# EAGLE schematic EPS (EAGLE 9.5.1), part 1 of 2
DESIGNER: Bradley L. Davis; PART_NUMBER: 68-0002; PROJECT: CougSat-1: EPS; REV: 3.1.0

## Sheet 1 of 13
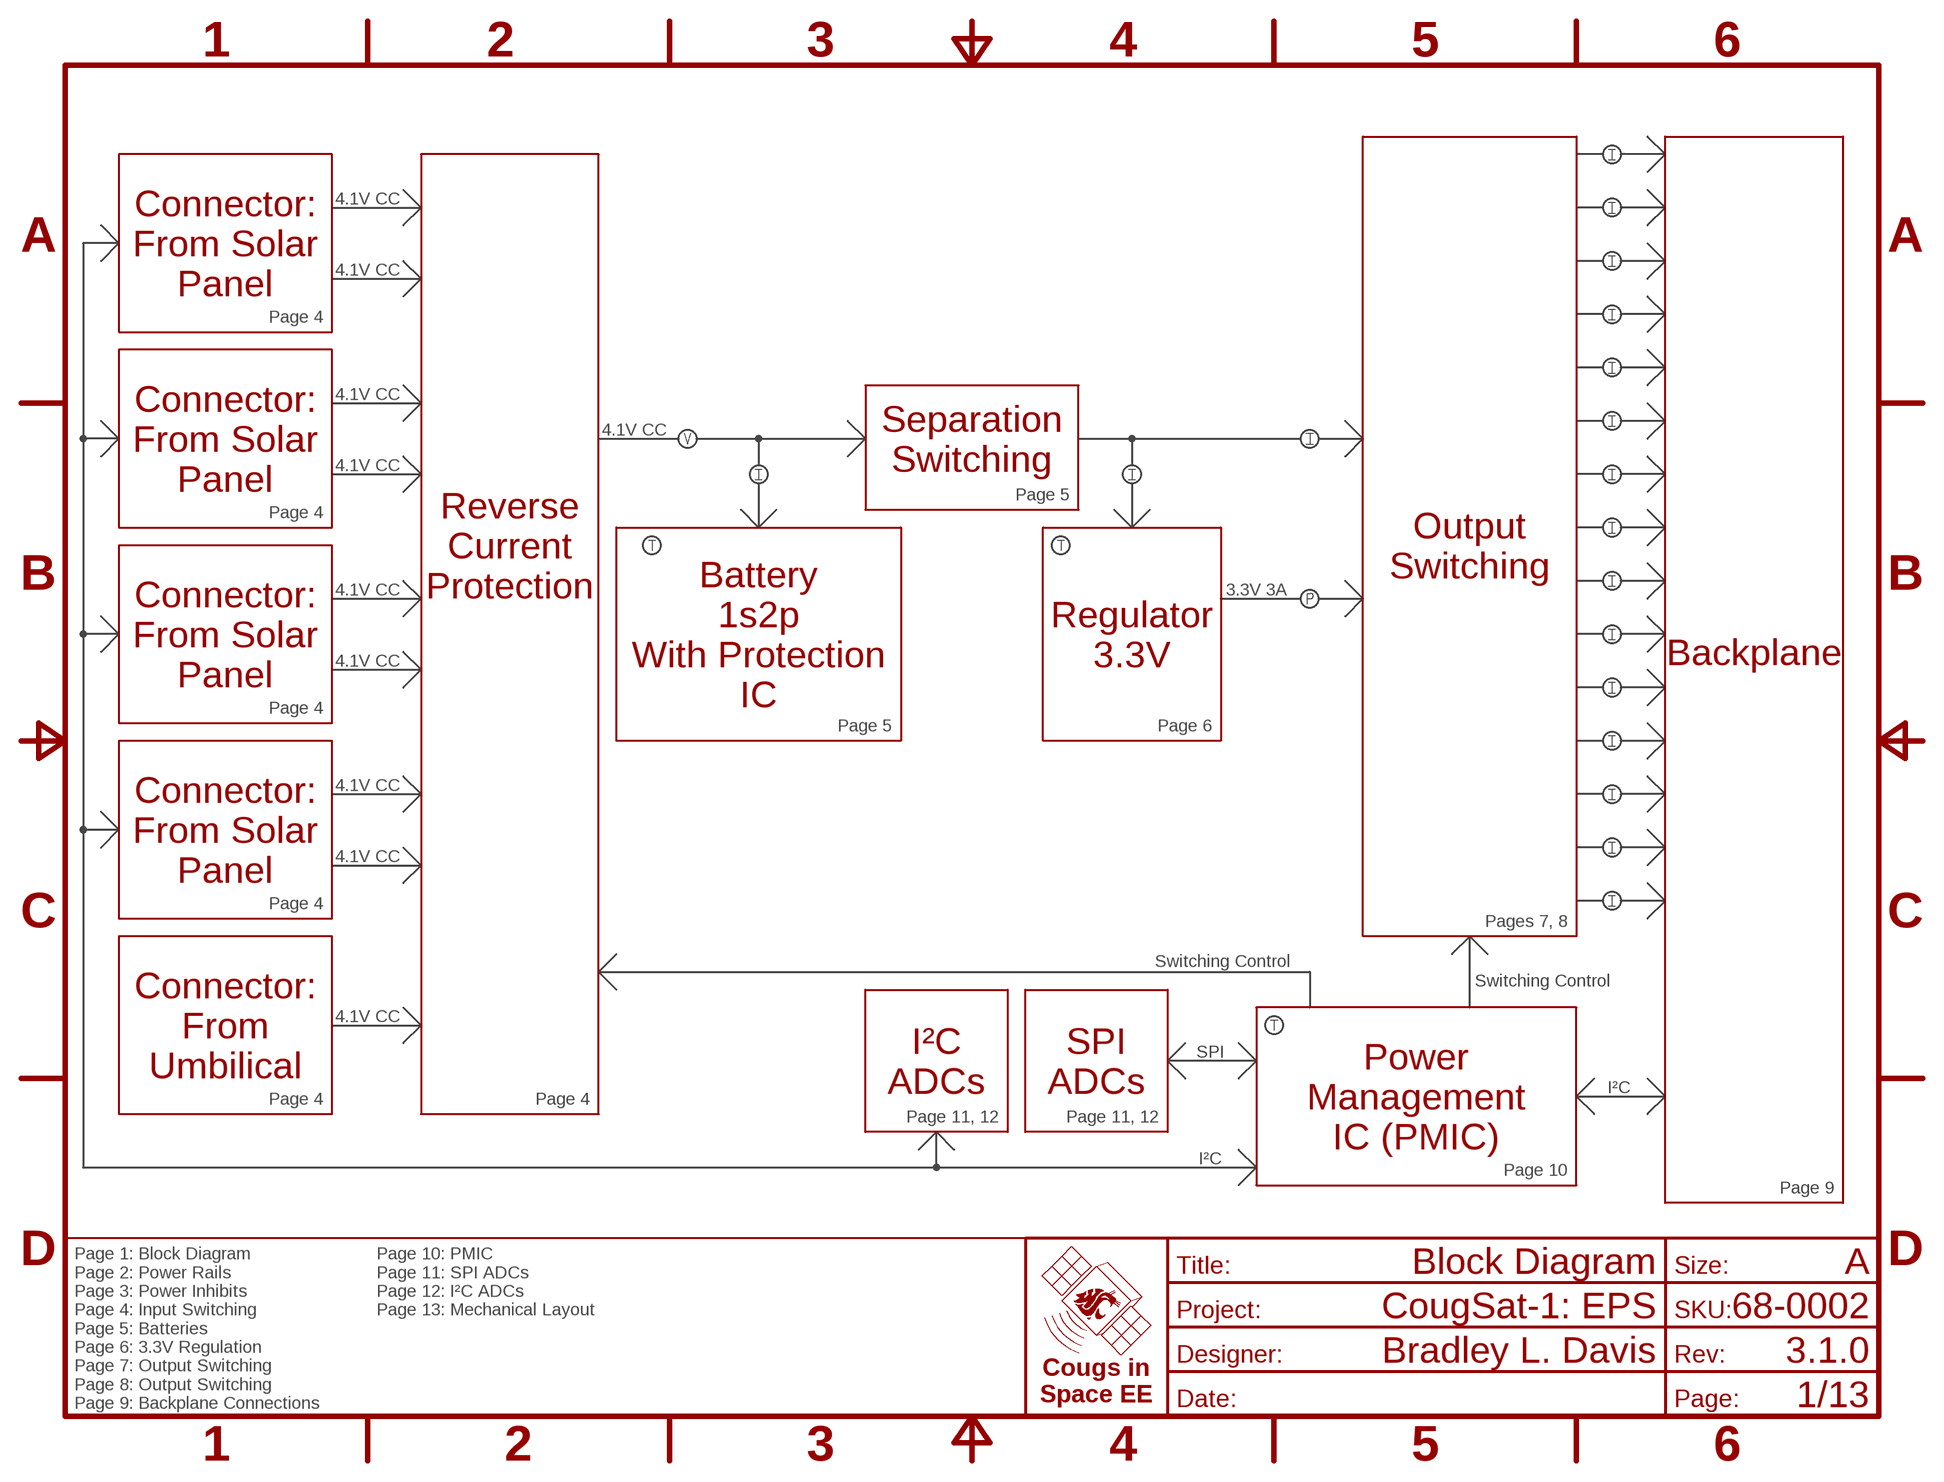
[diagram p0: schematic, sheet 1]
FRAME1 (FRAME-A): TITLE: Block Diagram

### Notes on the sheet
- 4.1V CC
- Connector:
  From Solar
  Panel
- 4.1V CC
- Page 4
- 4.1V CC
- 4.1V CC
- Connector:
  From Solar
  Panel
- Separation
  Switching
- 4.1V CC
- Page 5
- Page 4
- Reverse
  Current
  Protection
- Output
  Switching
- 4.1V CC | 3.3V 3A
- Connector:
  From Solar
  Panel
- Battery
  1s2p
  With Protection
  IC
- Regulator
  3.3V
- Backplane
- 4.1V CC
- Page 4
- Page 5 | Page 6
- 4.1V CC
- Connector:
  From Solar
  Panel
- 4.1V CC
- Page 4
- Pages 7, 8
- Switching Control
- Switching Control
- 4.1V CC
- Connector:
  From
  Umbilical
- SPI
- I²C
  ADCs
- SPI
  ADCs
- I²C
- Power
  Management
  IC (PMIC)
- Page 4 | Page 4
- Page 11, 12 | Page 11, 12
- I²C
- Page 10
- Page 9
- Page 1: Block Diagram
  Page 2: Power Rails
  Page 3: Power Inhibits
  Page 4: Input Switching
  Page 5: Batteries
  Page 6: 3.3V Regulation
  Page 7: Output Switching
  Page 8: Output Switching
  Page 9: Backplane Connections
- Page 10: PMIC
  Page 11: SPI ADCs
  Page 12: I²C ADCs
  Page 13: Mechanical Layout

## Sheet 2 of 13
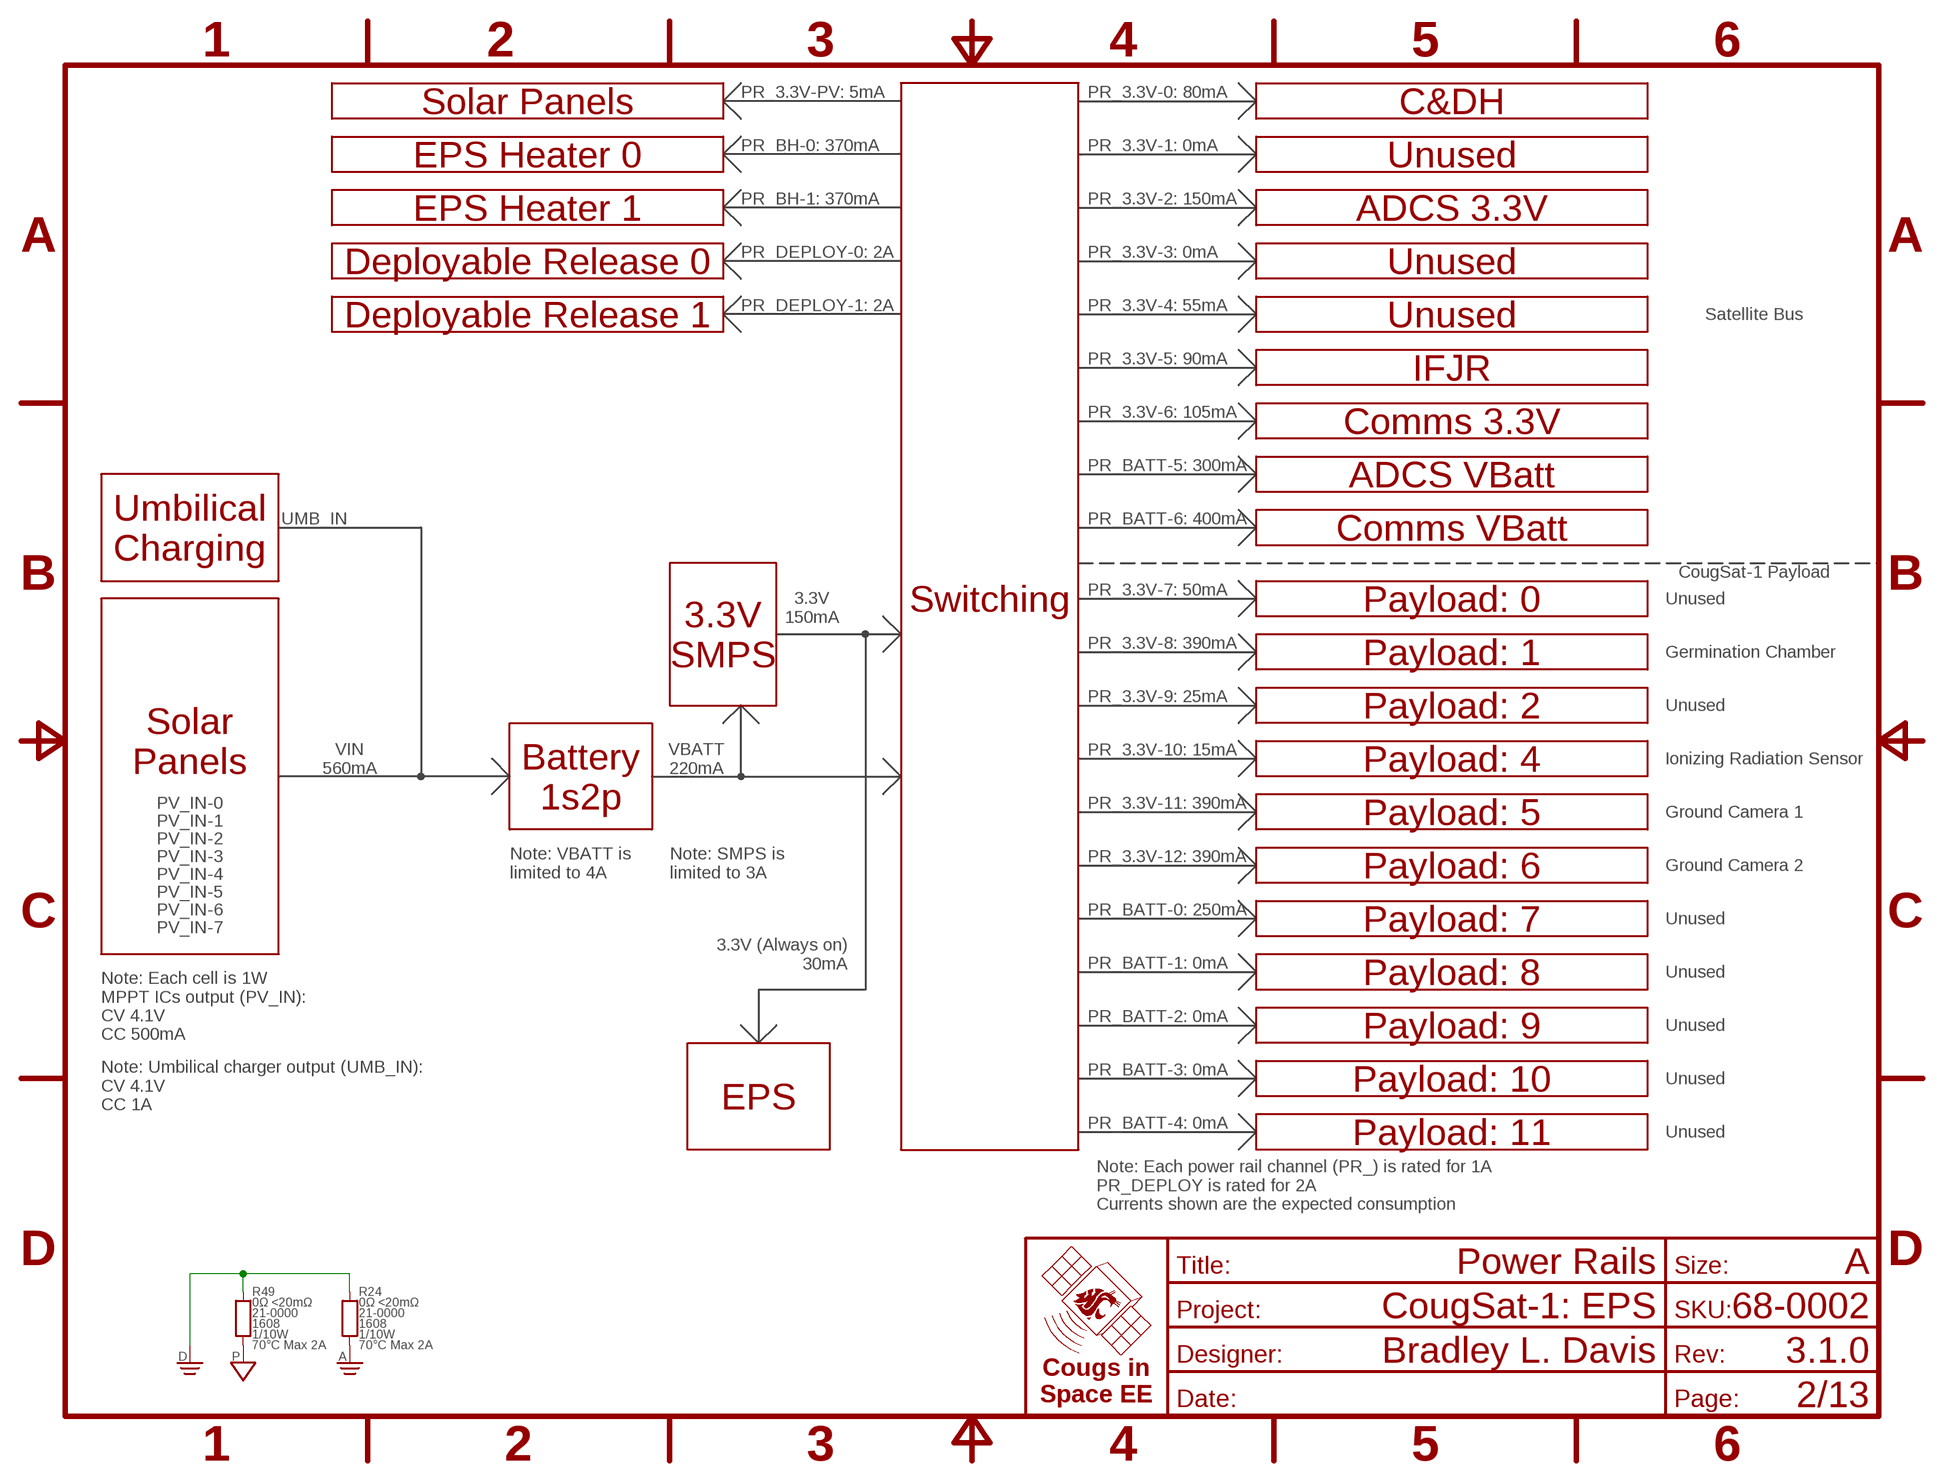
[diagram p1: schematic, sheet 2]
FRAME2 (FRAME-A): TITLE: Power Rails

### Parts
R24  0Ω <20mΩ  RES-V-0-1608  [1608]
R49  0Ω <20mΩ  RES-V-0-1608  [1608]

### Nets
AGND [power]: R24.1 ; also sheet 4,5,6,7,8,11,12
DGND [power]: R24.2 R49.2 ; also sheet 9,10,11,12
PGND [power]: R49.1 ; also sheet 4,5,6,7,8,9,12

### Notes on the sheet
- PR_3.3V-PV: 5mA | PR_3.3V-0: 80mA
- Solar Panels | C&DH
- PR_BH-0: 370mA | PR_3.3V-1: 0mA
- EPS Heater 0 | Unused
- PR_BH-1: 370mA | PR_3.3V-2: 150mA
- EPS Heater 1 | ADCS 3.3V
- PR_DEPLOY-0: 2A | PR_3.3V-3: 0mA
- Deployable Release 0 | Unused
- PR_DEPLOY-1: 2A | PR_3.3V-4: 55mA
- Deployable Release 1 | Unused | Satellite Bus
- PR_3.3V-5: 90mA
- IFJR
- PR_3.3V-6: 105mA
- Comms 3.3V
- PR_BATT-5: 300mA
- ADCS VBatt
- UMB_IN | PR_BATT-6: 400mA
- Umbilical
  Charging
- Comms VBatt
- CougSat-1 Payload
- PR_3.3V-7: 50mA
- Switching | Payload: 0 | Unused
- 3.3V
  150mA
- 3.3V
  SMPS
- PR_3.3V-8: 390mA
- Payload: 1 | Germination Chamber
- PR_3.3V-9: 25mA
- Payload: 2 | Unused
- Solar
  Panels
- PR_3.3V-10: 15mA
- VIN
  560mA
- VBATT
  220mA
- Payload: 4 | Ionizing Radiation Sensor
- Battery
  1s2p
- PV_IN-0 | PR_3.3V-11: 390mA
- Payload: 5 | Ground Camera 1
- PV_IN-1
- PV_IN-2
- Note: VBATT is
  limited to 4A
- Note: SMPS is
  limited to 3A
- PV_IN-3 | PR_3.3V-12: 390mA
- Payload: 6 | Ground Camera 2
- PV_IN-4
- PV_IN-5
- PV_IN-6 | PR_BATT-0: 250mA
- Payload: 7 | Unused
- PV_IN-7
- 3.3V (Always on)
  30mA
- PR_BATT-1: 0mA
- Note: Each cell is 1W
  MPPT ICs output (PV_IN):
  CV 4.1V 
  CC 500mA
- Payload: 8 | Unused
- PR_BATT-2: 0mA
- Payload: 9 | Unused
- Note: Umbilical charger output (UMB_IN):
  CV 4.1V
  CC 1A
- PR_BATT-3: 0mA
- Payload: 10 | Unused
- EPS
- PR_BATT-4: 0mA
- Payload: 11 | Unused
- Note: Each power rail channel (PR_) is rated for 1A
  PR_DEPLOY is rated for 2A
  Currents shown are the expected consumption

## Sheet 3 of 13
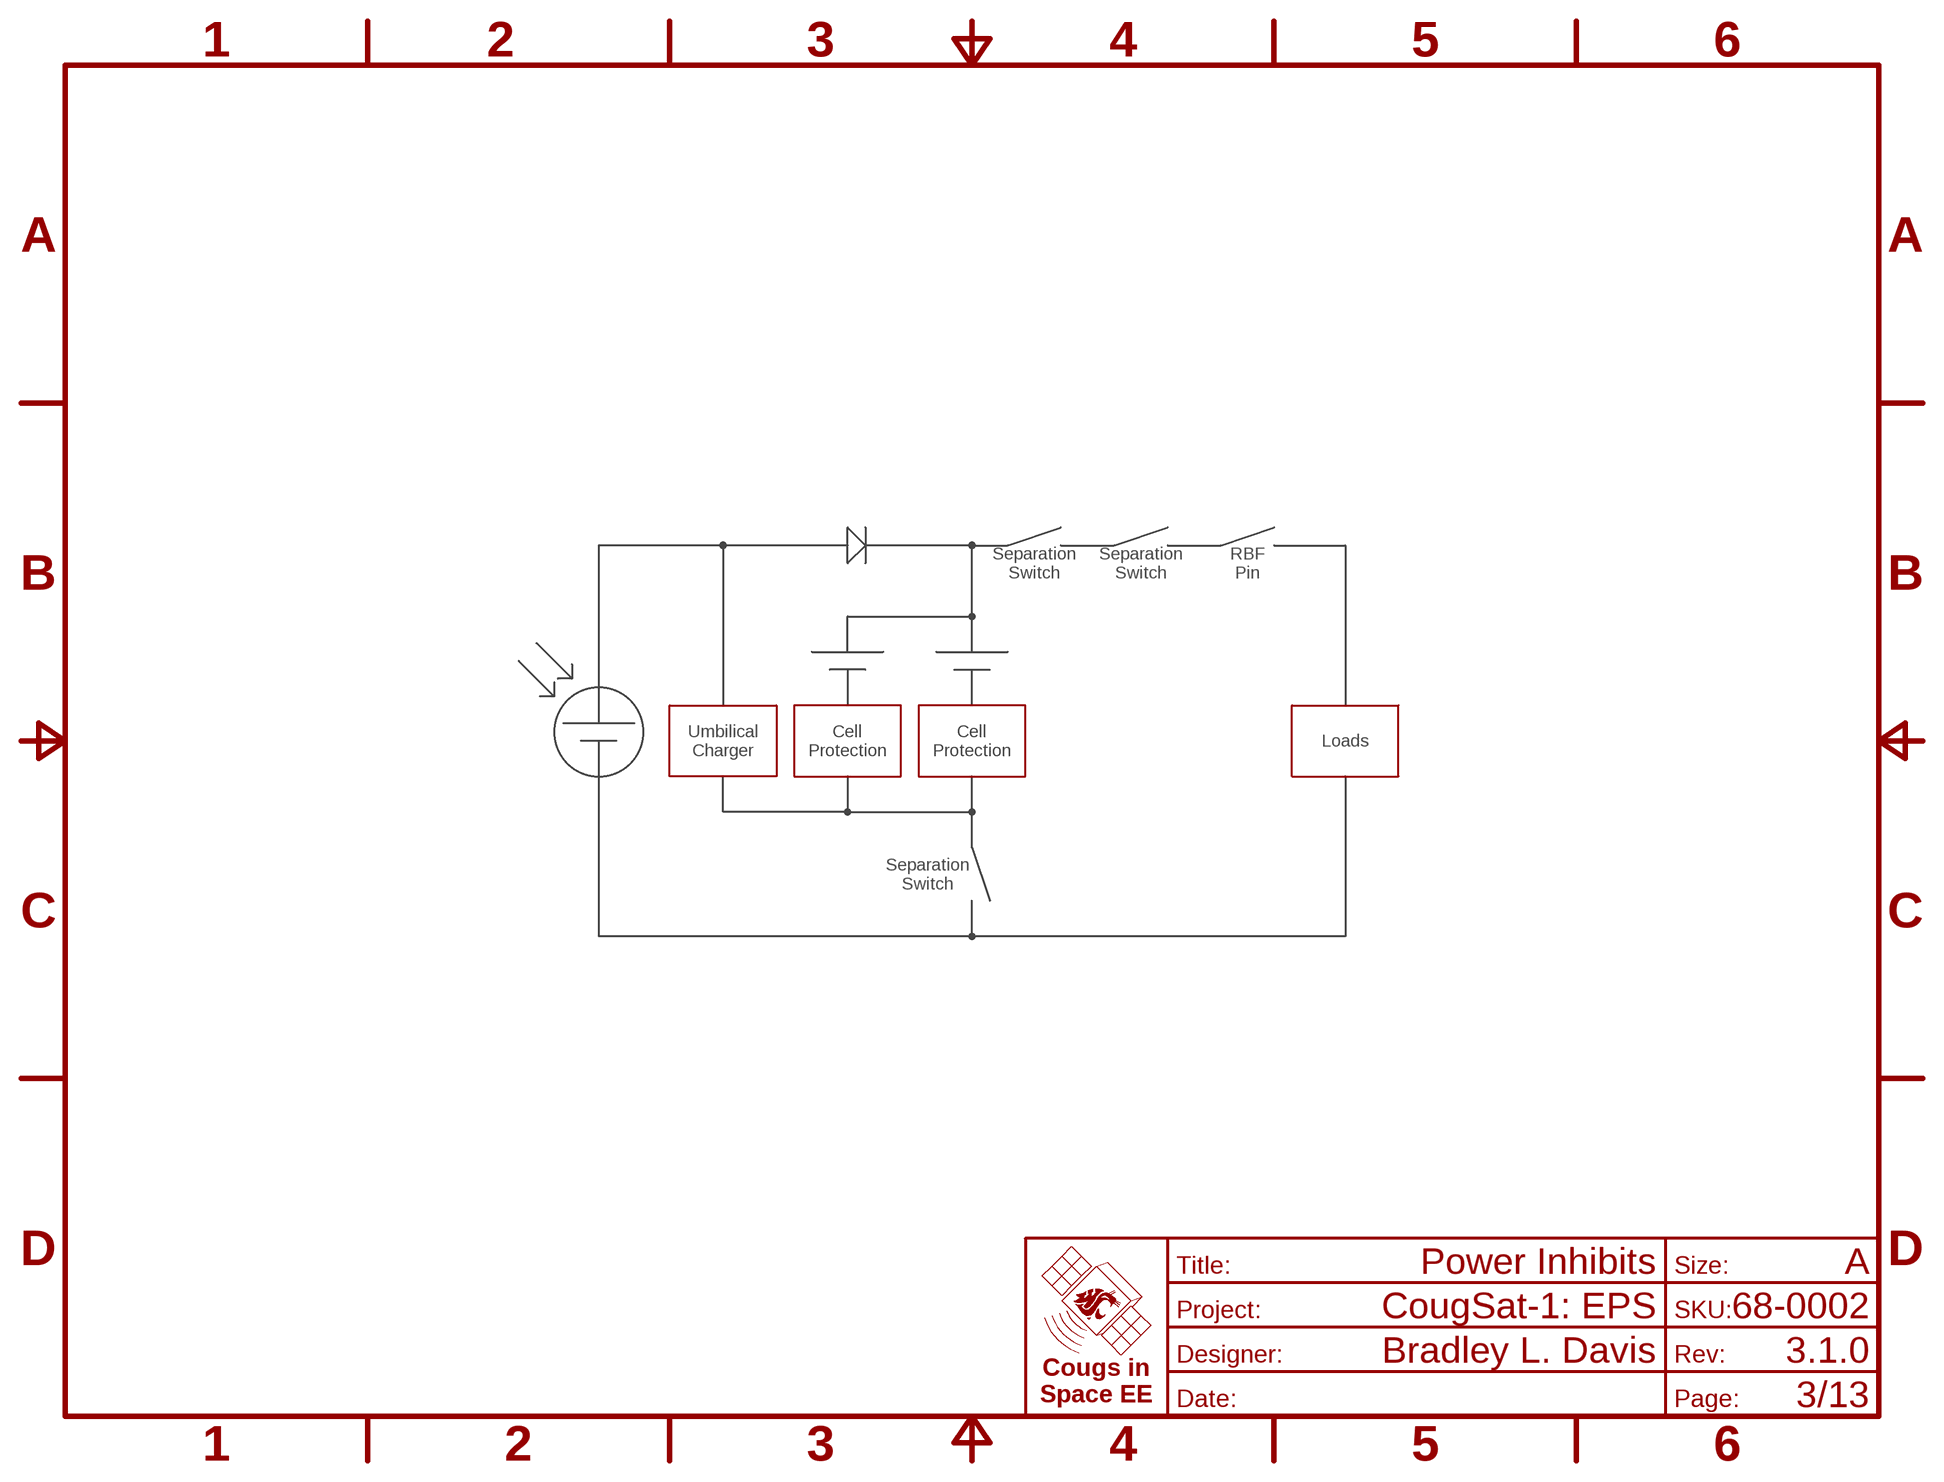
[diagram p2: schematic, sheet 3]
FRAME12 (FRAME-A): TITLE: Power Inhibits

### Notes on the sheet
- Separation
  Switch
- Separation
  Switch
- RBF
  Pin
- Umbilical
  Charger
- Cell
  Protection
- Cell
  Protection
- Loads
- Separation
  Switch

## Sheet 4 of 13
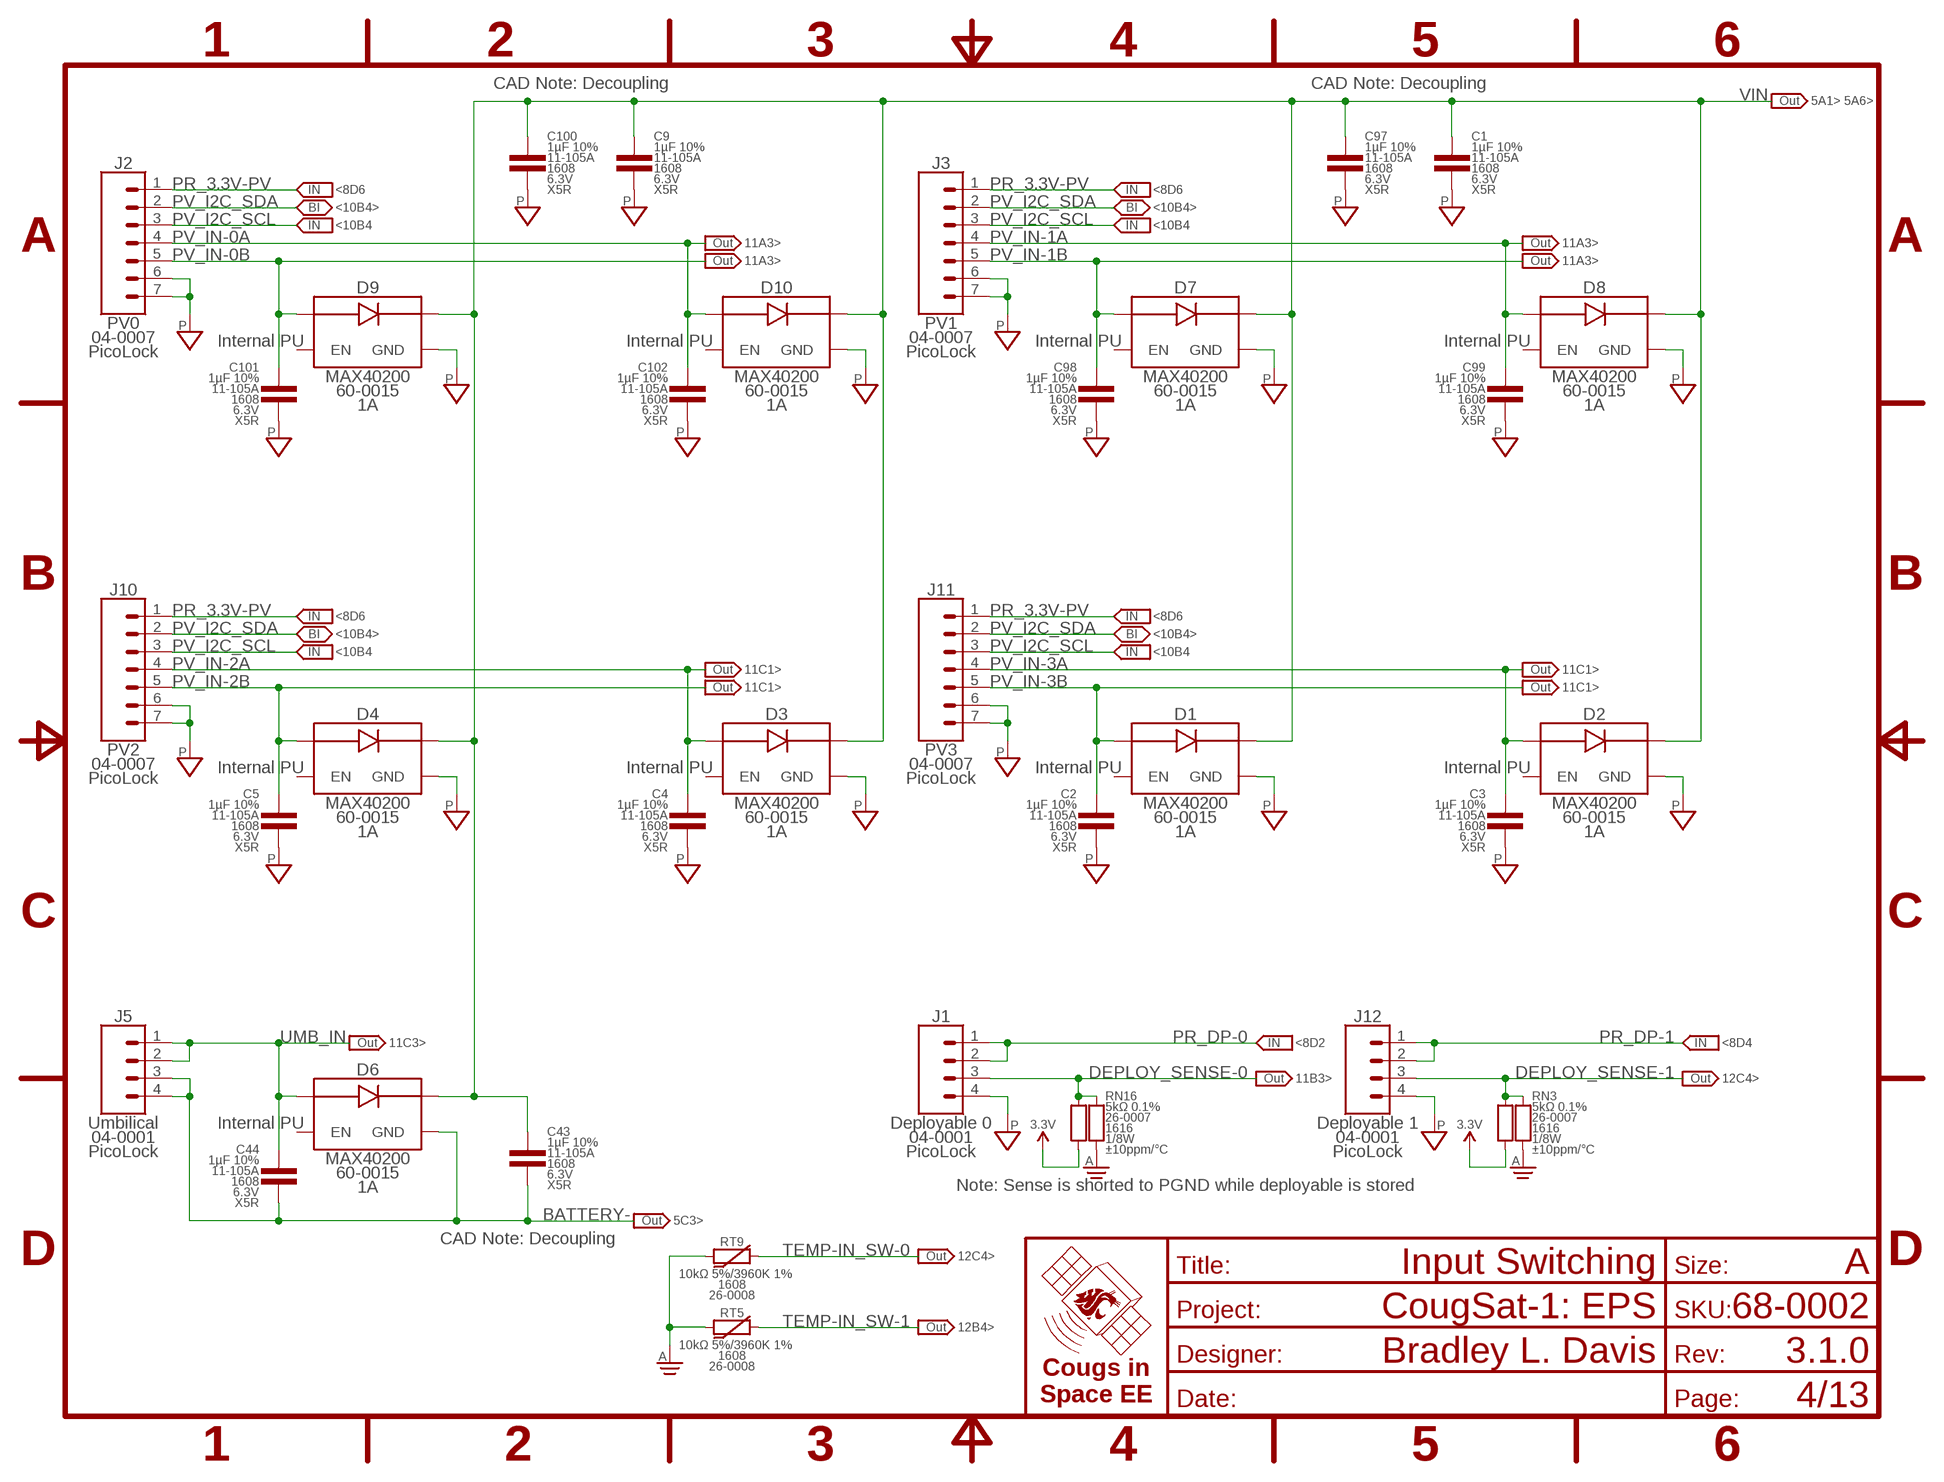
[diagram p3: schematic, sheet 4]
FRAME3 (FRAME-A): TITLE: Input Switching

### Parts
C1  1µF 10%  CAP-V-1UF-1608  [1608]
C2  1µF 10%  CAP-V-1UF-1608  [1608]
C3  1µF 10%  CAP-V-1UF-1608  [1608]
C4  1µF 10%  CAP-V-1UF-1608  [1608]
C5  1µF 10%  CAP-V-1UF-1608  [1608]
C9  1µF 10%  CAP-V-1UF-1608  [1608]
C43  1µF 10%  CAP-V-1UF-1608  [1608]
C44  1µF 10%  CAP-V-1UF-1608  [1608]
C97  1µF 10%  CAP-V-1UF-1608  [1608]
C98  1µF 10%  CAP-V-1UF-1608  [1608]
C99  1µF 10%  CAP-V-1UF-1608  [1608]
C100  1µF 10%  CAP-V-1UF-1608  [1608]
C101  1µF 10%  CAP-V-1UF-1608  [1608]
C102  1µF 10%  CAP-V-1UF-1608  [1608]
D1  MAX40200  [SOT23-5]
D2  MAX40200  [SOT23-5]
D3  MAX40200  [SOT23-5]
D4  MAX40200  [SOT23-5]
D6  MAX40200  [SOT23-5]
D7  MAX40200  [SOT23-5]
D8  MAX40200  [SOT23-5]
D9  MAX40200  [SOT23-5]
D10  MAX40200  [SOT23-5]
J1  Deployable 0  1X04-PICOLOCK  [PICOLOCK1.5-04]
J2  PV0  1X07-PICOLOCK  [PICOLOCK1.5-07]
J3  PV1  1X07-PICOLOCK  [PICOLOCK1.5-07]
J5  Umbilical  1X04-PICOLOCK  [PICOLOCK1.5-04]
J10  PV2  1X07-PICOLOCK  [PICOLOCK1.5-07]
J11  PV3  1X07-PICOLOCK  [PICOLOCK1.5-07]
J12  Deployable 1  1X04-PICOLOCK  [PICOLOCK1.5-04]
RN3  5kΩ 0.1%  RES-V-PAIRED-5K-1616  [1616]
RN16  5kΩ 0.1%  RES-V-PAIRED-5K-1616  [1616]
RT5  10kΩ 5%  THERMISTOR-H-10K-1608  [1608]
RT9  10kΩ 5%  THERMISTOR-H-10K-1608  [1608]

### Nets
3.3V [power]: RN3.2(B1) RN16.2(B1) ; also sheet 6,7,8,9,10,11,12
AGND [power]: RN3.1(A1) RN16.1(A1) RT5.1 RT9.1 ; also sheet 2,5,6,7,8,11,12
BATTERY- [power]: C43.2 C44.2 D6.2(GND) J5.3 J5.4 ; also sheet 5
DEPLOY_SENSE-0: J1.3 RN16.3(B2) RN16.4(A2) ; also sheet 11
DEPLOY_SENSE-1: J12.3 RN3.3(B2) RN3.4(A2) ; also sheet 12
PGND [power]: C1.2 C2.2 C3.2 C4.2 C5.2 C9.2 C97.2 C98.2 C99.2 C100.2 C101.2 C102.2 D1.2(GND) D2.2(GND) D3.2(GND) D4.2(GND) D7.2(GND) D8.2(GND) D9.2(GND) D10.2(GND) J1.4 J2.6 J2.7 J3.6 J3.7 J10.6 J10.7 J11.6 J11.7 J12.4 ; also sheet 2,5,6,7,8,9,12
PR_3.3V-PV [power]: J2.1 J3.1 J10.1 J11.1 ; also sheet 8,10
PR_DP-0 [power]: J1.1 J1.2 ; also sheet 8
PR_DP-1 [power]: J12.1 J12.2 ; also sheet 8
PV_I2C_SCL: J2.3 J3.3 J10.3 J11.3 ; also sheet 10
PV_I2C_SDA: J2.2 J3.2 J10.2 J11.2 ; also sheet 10
PV_IN-0A [power]: C102.1 D10.1(IN) J2.4 ; also sheet 11
PV_IN-0B [power]: C101.1 D9.1(IN) J2.5 ; also sheet 11
PV_IN-1A [power]: C99.1 D8.1(IN) J3.4 ; also sheet 11
PV_IN-1B [power]: C98.1 D7.1(IN) J3.5 ; also sheet 11
PV_IN-2A [power]: C4.1 D3.1(IN) J10.4 ; also sheet 11
PV_IN-2B [power]: C5.1 D4.1(IN) J10.5 ; also sheet 11
PV_IN-3A [power]: C3.1 D2.1(IN) J11.4 ; also sheet 11
PV_IN-3B [power]: C2.1 D1.1(IN) J11.5 ; also sheet 11
TEMP-IN_SW-0: RT9.2 ; also sheet 12
TEMP-IN_SW-1: RT5.2 ; also sheet 12
UMB_IN [power]: C44.1 D6.1(IN) J5.1 J5.2 ; also sheet 11
VIN [power]: C1.1 C9.1 C43.1 C97.1 C100.1 D1.5(OUT) D2.5(OUT) D3.5(OUT) D4.5(OUT) D6.5(OUT) D7.5(OUT) D8.5(OUT) D9.5(OUT) D10.5(OUT) ; also sheet 5
Unconnected: D1.3(EN) D2.3(EN) D3.3(EN) D4.3(EN) D6.3(EN) D7.3(EN) D8.3(EN) D9.3(EN) D10.3(EN)

### Notes on the sheet
- CAD Note: Decoupling | CAD Note: Decoupling
- 5A1> 5A6>
- <8D6 | <8D6
- <10B4> | <10B4>
- <10B4 | <10B4
- 11A3> | 11A3>
- 11A3> | 11A3>
- Internal PU | Internal PU | Internal PU | Internal PU
- <8D6 | <8D6
- <10B4> | <10B4>
- <10B4 | <10B4
- 11C1> | 11C1>
- 11C1> | 11C1>
- Internal PU | Internal PU | Internal PU | Internal PU
- 11C3> | <8D2 | <8D4
- 11B3> | 12C4>
- Internal PU
- Note: Sense is shorted to PGND while deployable is stored
- 5C3>
- CAD Note: Decoupling
- 12C4>
- 12B4>

## Sheet 5 of 13
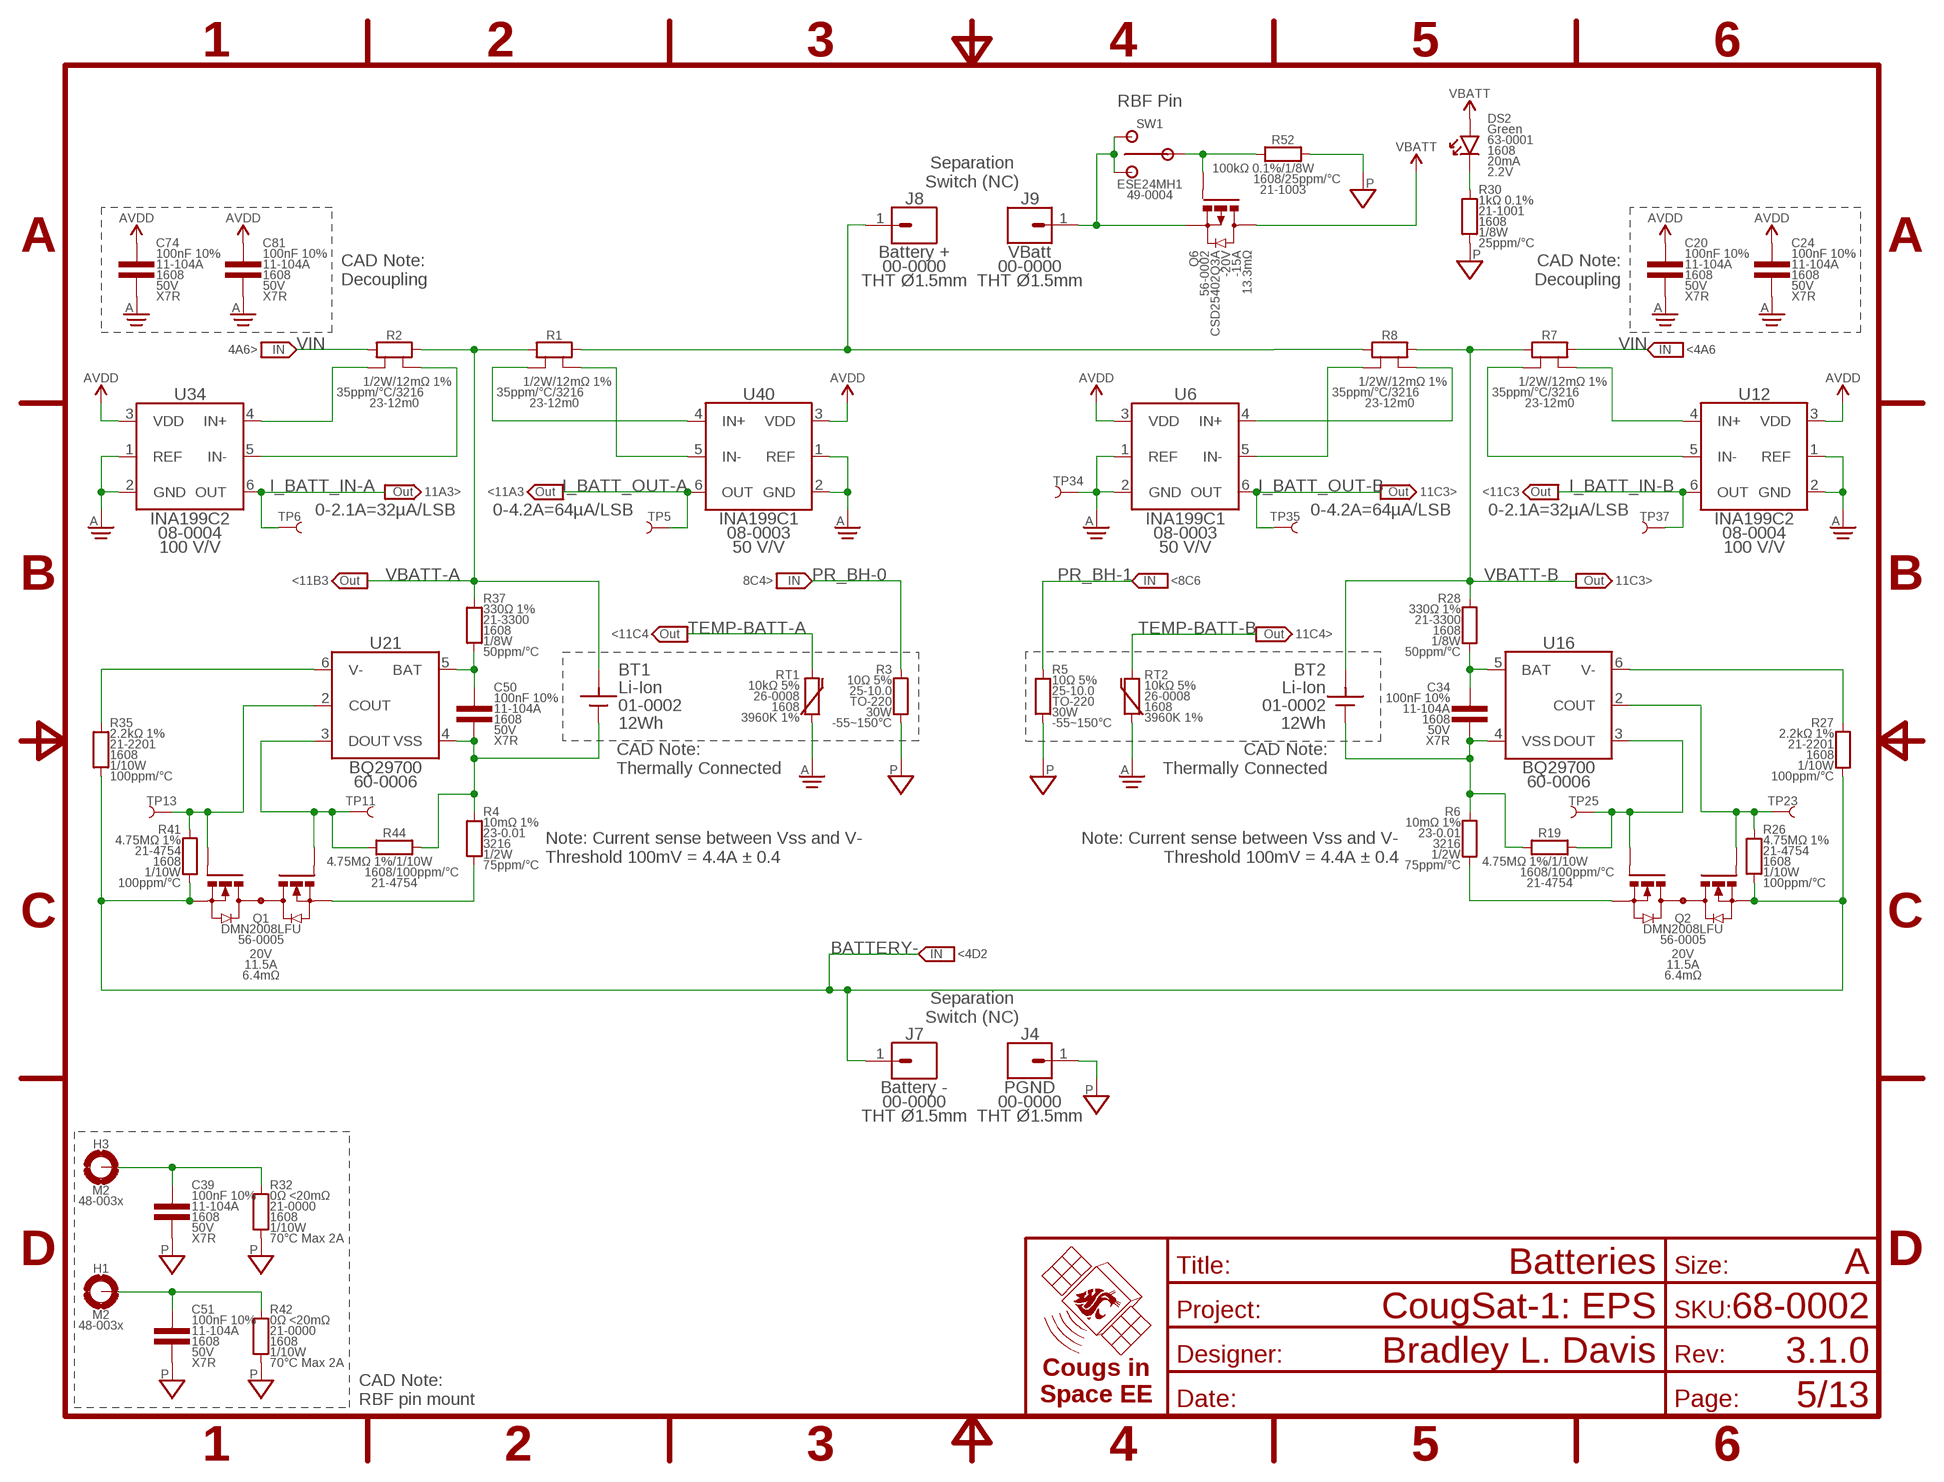
[diagram p4: schematic, sheet 5]
FRAME8 (FRAME-A): TITLE: Batteries

### Parts
BT1  Li-Ion  BATTERY-18650NCR  [18650-SOLDERED]
BT2  Li-Ion  BATTERY-18650NCR  [18650-SOLDERED]
C20  100nF 10%  CAP-V-100NF-1608  [1608]
C24  100nF 10%  CAP-V-100NF-1608  [1608]
C34  100nF 10%  CAP-V-100NF-1608  [1608]
C39  100nF 10%  CAP-V-100NF-1608  [1608]
C50  100nF 10%  CAP-V-100NF-1608  [1608]
C51  100nF 10%  CAP-V-100NF-1608  [1608]
C74  100nF 10%  CAP-V-100NF-1608  [1608]
C81  100nF 10%  CAP-V-100NF-1608  [1608]
DS2  Green  LED-V-GRN-1608  [1608-POL]
H1  M2  MOUNTING_HOLE-2.2  [MOUNTING_HOLE-2.2]
H3  M2  MOUNTING_HOLE-2.2  [MOUNTING_HOLE-2.2]
J4  PGND  1X01-THT-1.5  [THT-1.5]
J7  Battery -  1X01-THT-1.5  [THT-1.5]
J8  Battery +  1X01-THT-1.5  [THT-1.5]
J9  VBatt  1X01-THT-1.5  [THT-1.5]
Q1  DMN2008LFU  MOSFET_DUAL_COM_D-N-DMN2008LFU-UDFN-6-B  [UDFN-6-B]
Q2  DMN2008LFU  MOSFET_DUAL_COM_D-N-DMN2008LFU-UDFN-6-B  [UDFN-6-B]
Q6  CSD25402Q3A  MOSFET-P-SON-3333  [SON-3333]
R1  12mΩ 1%  RES-H-KELVIN-0.012R-3216  [3216-KELVIN]
R2  12mΩ 1%  RES-H-KELVIN-0.012R-3216  [3216-KELVIN]
R3  10Ω 5%  RES-V-10R-TO220  [TO-220-2]
R4  10mΩ 1%  RES-V-0.01R-3216  [3216]
R5  10Ω 5%  RES-V-10R-TO220  [TO-220-2]
R6  10mΩ 1%  RES-V-0.01R-3216  [3216]
R7  12mΩ 1%  RES-H-KELVIN-0.012R-3216  [3216-KELVIN]
R8  12mΩ 1%  RES-H-KELVIN-0.012R-3216  [3216-KELVIN]
R19  4.75MΩ 1%  RES-H-4.75M-1608  [1608]
R26  4.75MΩ 1%  RES-V-4.75M-1608  [1608]
R27  2.2kΩ 1%  RES-V-2.2K-1608  [1608]
R28  330Ω 1%  RES-V-330R-1608  [1608]
R30  1kΩ 0.1%  RES-V-1K-1608  [1608]
R32  0Ω <20mΩ  RES-V-0-1608  [1608]
R35  2.2kΩ 1%  RES-V-2.2K-1608  [1608]
R37  330Ω 1%  RES-V-330R-1608  [1608]
R41  4.75MΩ 1%  RES-V-4.75M-1608  [1608]
R42  0Ω <20mΩ  RES-V-0-1608  [1608]
R44  4.75MΩ 1%  RES-H-4.75M-1608  [1608]
R52  100kΩ 0.1%  RES-H-100K-1608  [1608]
RT1  10kΩ 5%  THERMISTOR-V-10K-1608  [1608]
RT2  10kΩ 5%  THERMISTOR-V-10K-1608  [1608]
SW1  ESE24MH1  SWITCH-SPDT-MOMESE24MH1  [ESE24MH1]
TP5  TEST_POINT-SMD-C-1.25  [SMD-C-1.25]
TP6  TEST_POINT-SMD-C-1.25  [SMD-C-1.25]
TP11  TEST_POINT-SMD-C-1.25  [SMD-C-1.25]
TP13  TEST_POINT-SMD-C-1.25  [SMD-C-1.25]
TP23  TEST_POINT-SMD-C-1.25  [SMD-C-1.25]
TP25  TEST_POINT-SMD-C-1.25  [SMD-C-1.25]
TP34  TEST_POINT-SMD-C-1.25  [SMD-C-1.25]
TP35  TEST_POINT-SMD-C-1.25  [SMD-C-1.25]
TP37  TEST_POINT-SMD-C-1.25  [SMD-C-1.25]
U6  INA199C1  [SOT363]
U12  INA199C2  [SOT363]
U16  BQ29700  [WSON-6]
U21  BQ29700  [WSON-6]
U34  INA199C2  [SOT363]
U40  INA199C1  [SOT363]

### Nets
AGND [power]: C20.2 C24.2 C74.2 C81.2 RT1.1 RT2.1 TP34.1 U6.1(REF) U6.2(GND) U12.1(REF) U12.2(GND) U34.1(REF) U34.2(GND) U40.1(REF) U40.2(GND) ; also sheet 2,4,6,7,8,11,12
AVDD [power]: C20.1 C24.1 C74.1 C81.1 U6.3(VDD) U12.3(VDD) U34.3(VDD) U40.3(VDD) ; also sheet 6,7,8,10,11,12
BATT_PROTECT_BAT-A [power]: C50.1 R37.1 U21.5(BAT)
BATT_PROTECT_BAT-B [power]: C34.1 R28.1 U16.5(BAT)
BATT_PROTECT_COUT-A: Q1.3(G1) R41.2 TP13.1 U21.2(COUT)
BATT_PROTECT_COUT-B: Q2.4(G2) R26.2 TP23.1 U16.2(COUT)
BATT_PROTECT_DOUT-A: Q1.4(G2) R44.1 TP11.1 U21.3(DOUT)
BATT_PROTECT_DOUT-B: Q2.3(G1) R19.2 TP25.1 U16.3(DOUT)
BATT_PROTECT_GND-A: R35.2 U21.6(V-)
BATT_PROTECT_GND-B: R27.2 U16.6(V-)
BATTERY+: J8.1 R1.1 R8.2
BATTERY- [power]: J7.1 Q1.1(S1) Q2.6(S2) R26.1 R27.1 R35.1 R41.1 ; also sheet 4
BP_VSS-A [power]: BT1.A C50.2 R4.2 R44.2 U21.4(VSS)
BP_VSS-B [power]: BT2.A C34.2 R6.2 R19.1 U16.4(VSS)
BP_VSS_I-A [power]: Q1.6(S2) R4.1
BP_VSS_I-B [power]: Q2.1(S1) R6.1
CHASSIS_RBF0 [power]: C39.1 H3.1(MOUNT) H3.V1(MOUNT) H3.V2(MOUNT) H3.V3(MOUNT) H3.V4(MOUNT) H3.V5(MOUNT) H3.V6(MOUNT) H3.V7(MOUNT) H3.V8(MOUNT) R32.2
CHASSIS_RBF1 [power]: C51.1 H1.1(MOUNT) H1.V1(MOUNT) H1.V2(MOUNT) H1.V3(MOUNT) H1.V4(MOUNT) H1.V5(MOUNT) H1.V6(MOUNT) H1.V7(MOUNT) H1.V8(MOUNT) R42.2
I_BATT_IN-A: TP6.1 U34.6(OUT) ; also sheet 11
I_BATT_IN-A_N: R2.1-KELVIN U34.5(IN-)
I_BATT_IN-A_P: R2.2-KELVIN U34.4(IN+)
I_BATT_IN-B: TP37.1 U12.6(OUT) ; also sheet 11
I_BATT_IN-B_N: R7.2-KELVIN U12.5(IN-)
I_BATT_IN-B_P: R7.1-KELVIN U12.4(IN+)
I_BATT_OUT-A: TP5.1 U40.6(OUT) ; also sheet 11
I_BATT_OUT-A_N: R1.1-KELVIN U40.5(IN-)
I_BATT_OUT-A_P: R1.2-KELVIN U40.4(IN+)
I_BATT_OUT-B: TP35.1 U6.6(OUT) ; also sheet 11
I_BATT_OUT-B_N: R8.2-KELVIN U6.5(IN-)
I_BATT_OUT-B_P: R8.1-KELVIN U6.4(IN+)
PGND [power]: C39.2 C51.2 J4.1 R3.1 R5.1 R30.1 R32.1 R42.1 R52.2 ; also sheet 2,4,6,7,8,9,12
PR_BH-0 [power]: R3.3 ; also sheet 8
PR_BH-1 [power]: R5.3 ; also sheet 8
RBF_GATE: Q6.4(G) R52.1 SW1.C
TEMP-BATT-A: RT1.2 ; also sheet 12
TEMP-BATT-B: RT2.2 ; also sheet 12
VBATT [power]: DS2.A Q6.1(D) Q6.2(D) Q6.3(D) ; also sheet 6,8
VBATT-A [power]: BT1.C R1.2 R2.1 R37.2 ; also sheet 11
VBATT-B [power]: BT2.C R7.2 R8.1 R28.2 ; also sheet 11
VBATT_LED: DS2.C R30.2
VBATT_RBF: J9.1 Q6.5(S) Q6.6(S) Q6.7(S) Q6.8(S) Q6.PAD(S) SW1.1 SW1.2
VIN [power]: R2.2 R7.1 ; also sheet 4
Unconnected: Q1.PAD(D) Q2.PAD(D)

### Notes on the sheet
- RBF Pin
- Separation
  Switch (NC)
- CAD Note:
  Decoupling
- CAD Note:
  Decoupling
- 4A6> | <4A6
- 11A3> | <11A3 | 11C3> | <11C3
- 0-2.1A=32µA/LSB | 0-4.2A=64µA/LSB | 0-4.2A=64µA/LSB | 0-2.1A=32µA/LSB
- <11B3 | 8C4> | <8C6 | 11C3>
- <11C4 | 11C4>
- CAD Note:
  Thermally Connected
- CAD Note:
  Thermally Connected
- Note: Current sense between Vss and V-
  Threshold 100mV = 4.4A ± 0.4
- Note: Current sense between Vss and V-
  Threshold 100mV = 4.4A ± 0.4
- <4D2
- Separation
  Switch (NC)
- CAD Note:
  RBF pin mount

## Sheet 6 of 13
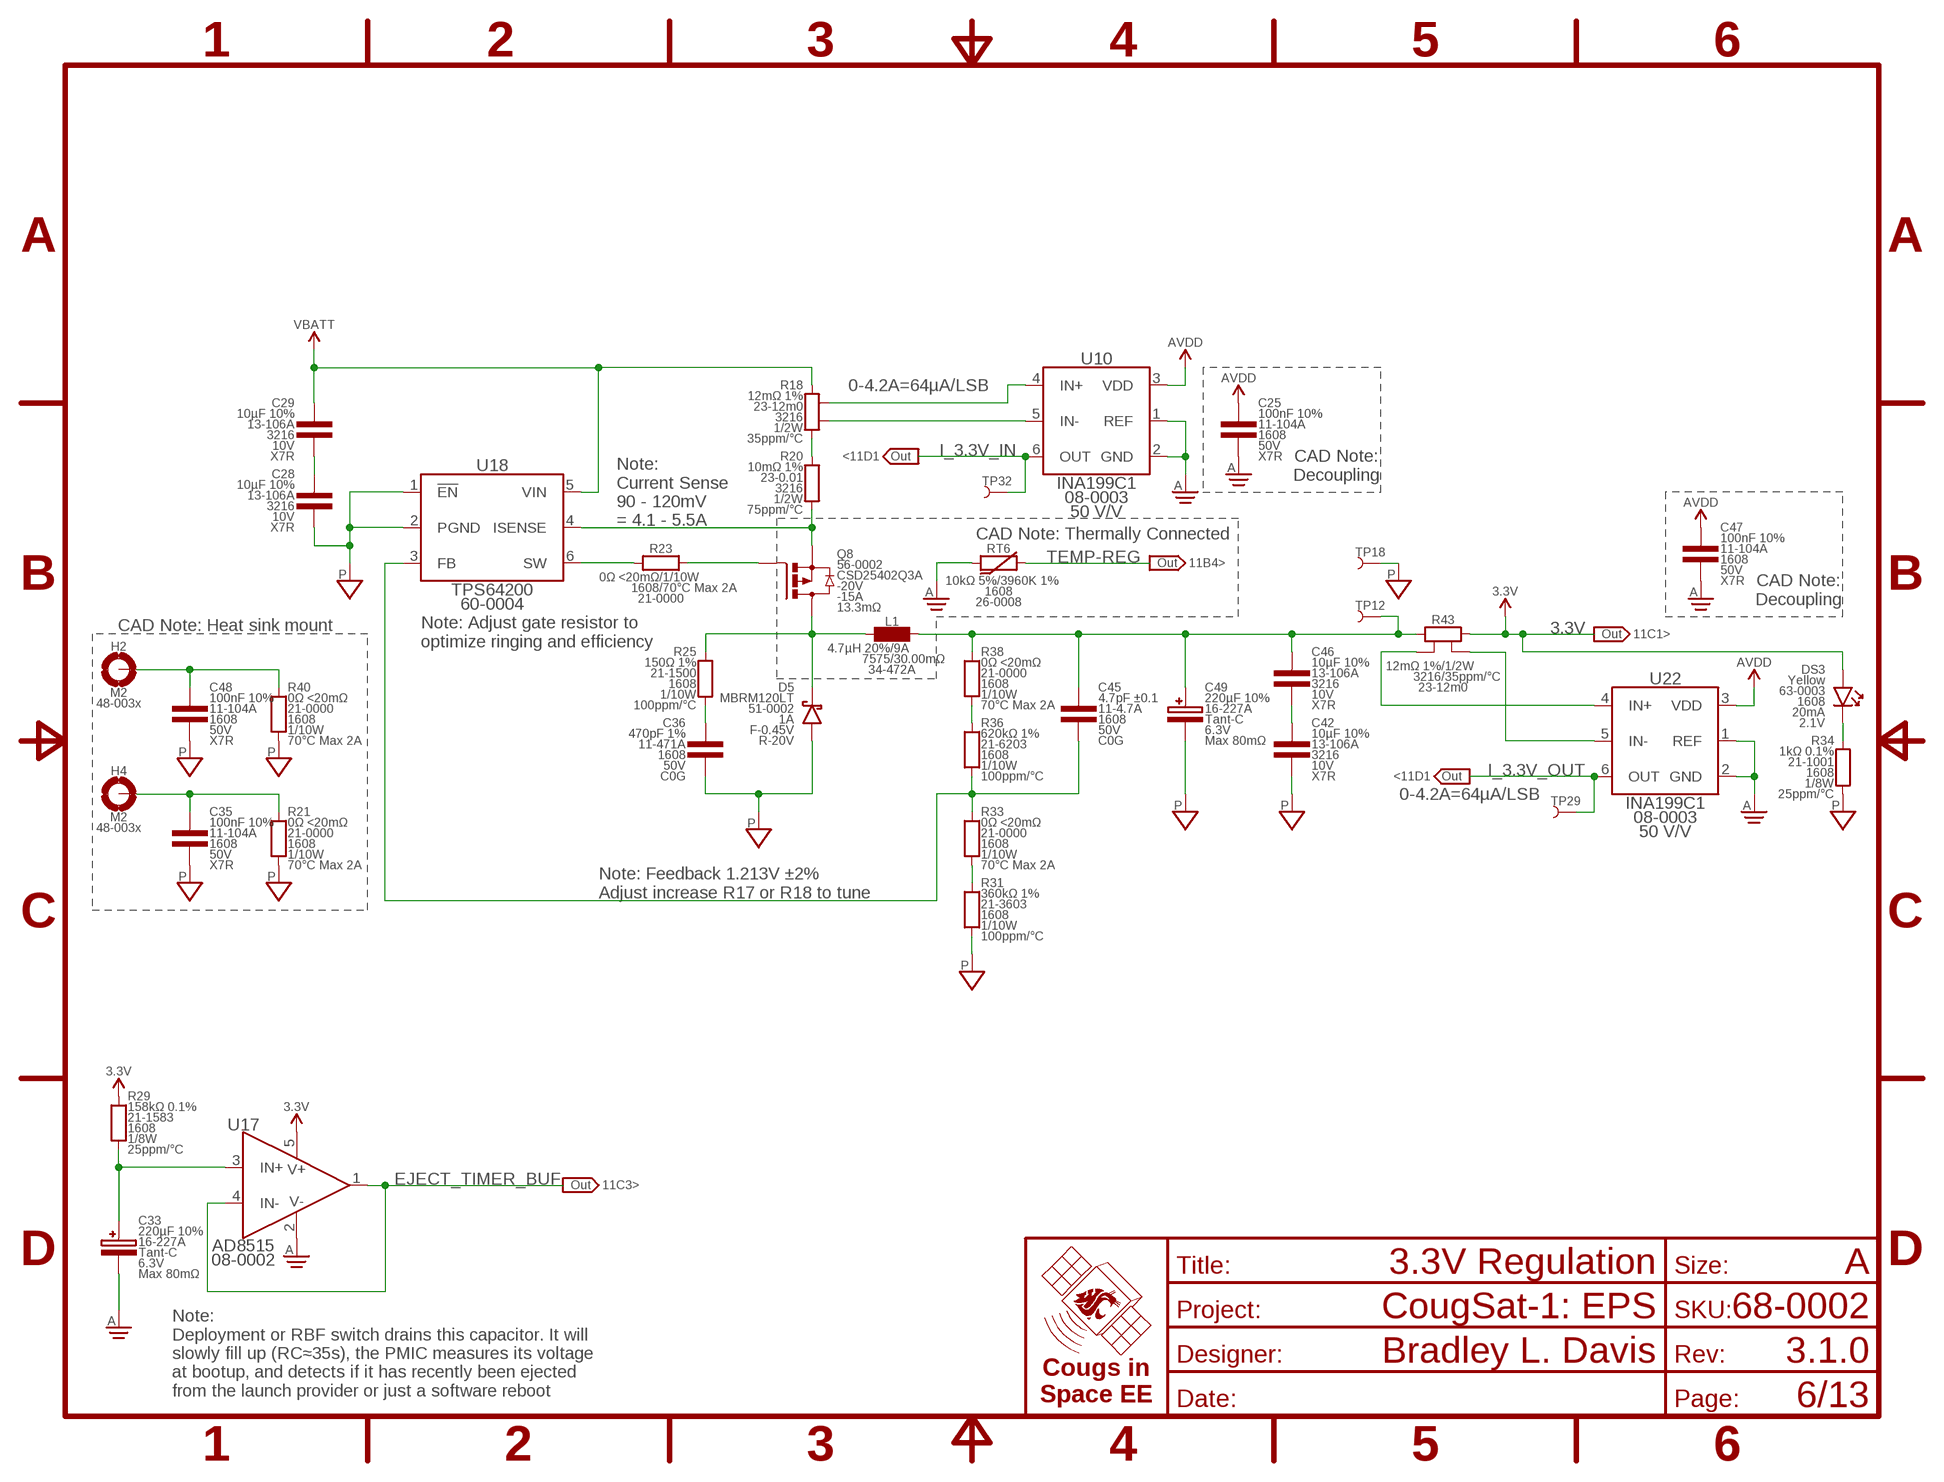
[diagram p5: schematic, sheet 6]
FRAME4 (FRAME-A): TITLE: 3.3V Regulation

### Parts
C25  100nF 10%  CAP-V-100NF-1608  [1608]
C28  10µF 10%  CAP-V-10UF-3216  [3216]
C29  10µF 10%  CAP-V-10UF-3216  [3216]
C33  220µF 10%  CAP-POL-V-220UF-7132  [7132-POL]
C35  100nF 10%  CAP-V-100NF-1608  [1608]
C36  470pF 1%  CAP-V-470PF-1608  [1608]
C42  10µF 10%  CAP-V-10UF-3216  [3216]
C45  4.7pF ±0.1  CAP-V-4.7PF-1608  [1608]
C46  10µF 10%  CAP-V-10UF-3216  [3216]
C47  100nF 10%  CAP-V-100NF-1608  [1608]
C48  100nF 10%  CAP-V-100NF-1608  [1608]
C49  220µF 10%  CAP-POL-V-220UF-7132  [7132-POL]
D5  MBRM120LT  DIODE-SCHOTTKY-V-POWERMITE  [POWERMITE]
DS3  Yellow  LED-V-YLW-1608  [1608-POL]
H2  M2  MOUNTING_HOLE-2.2  [MOUNTING_HOLE-2.2]
H4  M2  MOUNTING_HOLE-2.2  [MOUNTING_HOLE-2.2]
L1  4.7µH 20%  INDUCTOR-H-4.7UH-7575  [7575]
Q8  CSD25402Q3A  MOSFET-P-SON-3333  [SON-3333]
R18  12mΩ 1%  RES-V-KELVIN-0.012R-3216  [3216-KELVIN]
R20  10mΩ 1%  RES-V-0.01R-3216  [3216]
R21  0Ω <20mΩ  RES-V-0-1608  [1608]
R23  0Ω <20mΩ  RES-H-0-1608  [1608]
R25  150Ω 1%  RES-V-150R-1608  [1608]
R29  158kΩ 0.1%  RES-V-158K-1608  [1608]
R31  360kΩ 1%  RES-V-360K-1608  [1608]
R33  0Ω <20mΩ  RES-V-0-1608  [1608]
R34  1kΩ 0.1%  RES-V-1K-1608  [1608]
R36  620kΩ 1%  RES-V-620K-1608  [1608]
R38  0Ω <20mΩ  RES-V-0-1608  [1608]
R40  0Ω <20mΩ  RES-V-0-1608  [1608]
R43  12mΩ 1%  RES-H-KELVIN-0.012R-3216  [3216-KELVIN]
RT6  10kΩ 5%  THERMISTOR-H-10K-1608  [1608]
TP12  TEST_POINT-SMD-C-1.25  [SMD-C-1.25]
TP18  TEST_POINT-THT-0.7  [THT-0.7]
TP29  TEST_POINT-SMD-C-1.25  [SMD-C-1.25]
TP32  TEST_POINT-SMD-C-1.25  [SMD-C-1.25]
U10  INA199C1  [SOT363]
U17  AD8515  OPAMP-1-AD8515  [SOT23-5]
U18  TPS64200  [SOT23-6]
U22  INA199C1  [SOT363]

### Nets
3.3V [power]: DS3.A R29.2 R43.2 U17.5(V+) ; also sheet 4,7,8,9,10,11,12
3.3V_I [power]: C45.1 C46.1 C49.A L1.2 R38.2 R43.1 TP12.1
3.3V_ISENS [power]: Q8.5(S) Q8.6(S) Q8.7(S) Q8.8(S) Q8.PAD(S) R20.1 U18.4(ISENSE)
3.3V_LED: DS3.C R34.2
3.3V_REG_BUCK_NODE [power]: D5.C L1.1 Q8.1(D) Q8.2(D) Q8.3(D) R25.2
3.3V_REG_FB: C45.2 R33.2 R36.1 U18.3(FB)
3.3V_REG_FBRES_HIGH: R36.2 R38.1
3.3V_REG_FBRES_LOW: R31.2 R33.1
3.3V_REG_INCAP [power]: C28.1 C29.2
3.3V_REG_OUTCAP [power]: C42.1 C46.2
3.3V_REG_RSENS [power]: R18.1 R20.2
3.3V_REG_SNUBBER [power]: C36.1 R25.1
3.3V_REG_SW [power]: R23.1 U18.6(SW)
3.3V_REG_SW_GATE [power]: Q8.4(G) R23.2
AGND [power]: C25.2 C33.C C47.2 RT6.1 U10.1(REF) U10.2(GND) U17.2(V-) U22.1(REF) U22.2(GND) ; also sheet 2,4,5,7,8,11,12
AVDD [power]: C25.1 C47.1 U10.3(VDD) U22.3(VDD) ; also sheet 5,7,8,10,11,12
CHASSIS_REG1 [power]: C48.1 H2.1(MOUNT) H2.V1(MOUNT) H2.V2(MOUNT) H2.V3(MOUNT) H2.V4(MOUNT) H2.V5(MOUNT) H2.V6(MOUNT) H2.V7(MOUNT) H2.V8(MOUNT) R40.2
CHASSIS_REG2 [power]: C35.1 H4.1(MOUNT) H4.V1(MOUNT) H4.V2(MOUNT) H4.V3(MOUNT) H4.V4(MOUNT) H4.V5(MOUNT) H4.V6(MOUNT) H4.V7(MOUNT) H4.V8(MOUNT) R21.2
EJECT_TIMER: C33.A R29.1 U17.3(IN+)
EJECT_TIMER_BUF: U17.1(OUT) U17.4(IN-) ; also sheet 11
I_3.3V_IN: TP32.1 U10.6(OUT) ; also sheet 11
I_3.3V_IN_N: R18.1-KELVIN U10.5(IN-)
I_3.3V_IN_P: R18.2-KELVIN U10.4(IN+)
I_3.3V_OUT: TP29.1 U22.6(OUT) ; also sheet 11
I_3.3V_OUT_N: R43.2-KELVIN U22.5(IN-)
I_3.3V_OUT_P: R43.1-KELVIN U22.4(IN+)
PGND [power]: C28.2 C35.2 C36.2 C42.2 C48.2 C49.C D5.A R21.1 R31.1 R34.1 R40.1 TP18.1 U18.1(!EN) U18.2(PGND) ; also sheet 2,4,5,7,8,9,12
TEMP-REG: RT6.2 ; also sheet 12
VBATT [power]: C29.1 R18.2 U18.5(VIN) ; also sheet 5,8

### Notes on the sheet
- 0-4.2A=64µA/LSB
- <11D1
- CAD Note:
  Decoupling
- Note:
  Current Sense
  90 - 120mV
  = 4.1 - 5.5A
- CAD Note: Thermally Connected
- 11B4>
- CAD Note:
  Decoupling
- Note: Adjust gate resistor to
  optimize ringing and efficiency
- CAD Note: Heat sink mount
- 11C1>
- <11D1
- 0-4.2A=64µA/LSB
- Note: Feedback 1.213V ±2%
  Adjust increase R17 or R18 to tune
- 11C3>
- Note:
  Deployment or RBF switch drains this capacitor. It will
  slowly fill up (RC≈35s), the PMIC measures its voltage
  at bootup, and detects if it has recently been ejected
  from the launch provider or just a software reboot

## Sheet 7 of 13
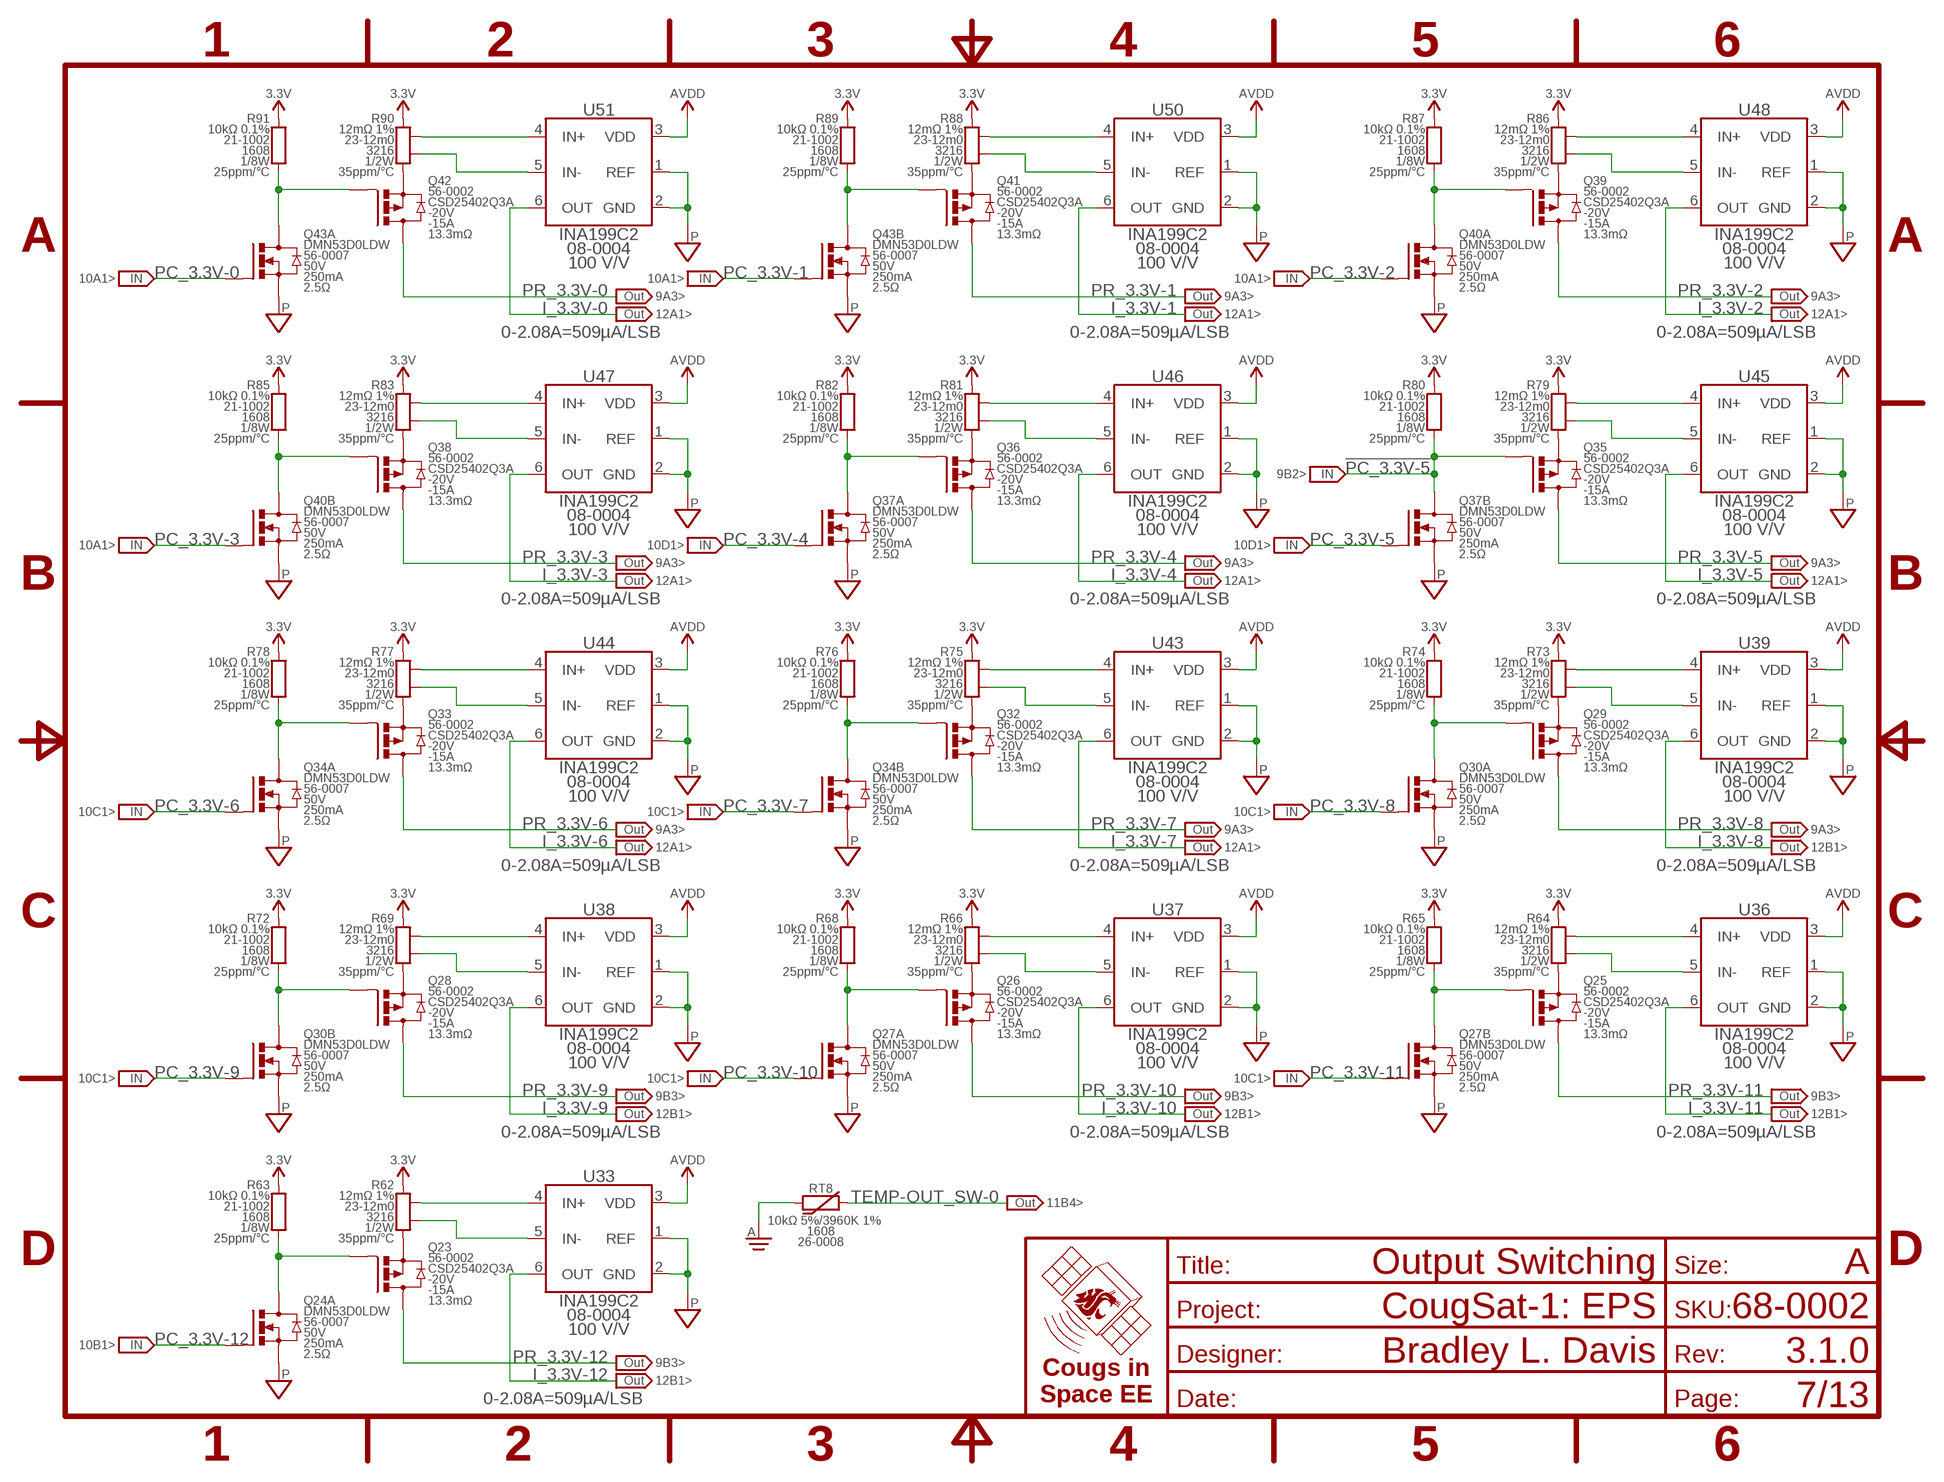
[diagram p6: schematic, sheet 7]
FRAME5 (FRAME-A): TITLE: Output Switching

### Parts
Q23  CSD25402Q3A  MOSFET-P-SON-3333  [SON-3333]
Q24  DMN53D0LDW  MOSFET_DUAL-N-DMN53D0LDW-SOT363  [SOT363]
Q25  CSD25402Q3A  MOSFET-P-SON-3333  [SON-3333]
Q26  CSD25402Q3A  MOSFET-P-SON-3333  [SON-3333]
Q27  DMN53D0LDW  MOSFET_DUAL-N-DMN53D0LDW-SOT363  [SOT363]
Q28  CSD25402Q3A  MOSFET-P-SON-3333  [SON-3333]
Q29  CSD25402Q3A  MOSFET-P-SON-3333  [SON-3333]
Q30  DMN53D0LDW  MOSFET_DUAL-N-DMN53D0LDW-SOT363  [SOT363]
Q32  CSD25402Q3A  MOSFET-P-SON-3333  [SON-3333]
Q33  CSD25402Q3A  MOSFET-P-SON-3333  [SON-3333]
Q34  DMN53D0LDW  MOSFET_DUAL-N-DMN53D0LDW-SOT363  [SOT363]
Q35  CSD25402Q3A  MOSFET-P-SON-3333  [SON-3333]
Q36  CSD25402Q3A  MOSFET-P-SON-3333  [SON-3333]
Q37  DMN53D0LDW  MOSFET_DUAL-N-DMN53D0LDW-SOT363  [SOT363]
Q38  CSD25402Q3A  MOSFET-P-SON-3333  [SON-3333]
Q39  CSD25402Q3A  MOSFET-P-SON-3333  [SON-3333]
Q40  DMN53D0LDW  MOSFET_DUAL-N-DMN53D0LDW-SOT363  [SOT363]
Q41  CSD25402Q3A  MOSFET-P-SON-3333  [SON-3333]
Q42  CSD25402Q3A  MOSFET-P-SON-3333  [SON-3333]
Q43  DMN53D0LDW  MOSFET_DUAL-N-DMN53D0LDW-SOT363  [SOT363]
R62  12mΩ 1%  RES-V-KELVIN-0.012R-3216  [3216-KELVIN]
R63  10kΩ 0.1%  RES-V-10K-1608  [1608]
R64  12mΩ 1%  RES-V-KELVIN-0.012R-3216  [3216-KELVIN]
R65  10kΩ 0.1%  RES-V-10K-1608  [1608]
R66  12mΩ 1%  RES-V-KELVIN-0.012R-3216  [3216-KELVIN]
R68  10kΩ 0.1%  RES-V-10K-1608  [1608]
R69  12mΩ 1%  RES-V-KELVIN-0.012R-3216  [3216-KELVIN]
R72  10kΩ 0.1%  RES-V-10K-1608  [1608]
R73  12mΩ 1%  RES-V-KELVIN-0.012R-3216  [3216-KELVIN]
R74  10kΩ 0.1%  RES-V-10K-1608  [1608]
R75  12mΩ 1%  RES-V-KELVIN-0.012R-3216  [3216-KELVIN]
R76  10kΩ 0.1%  RES-V-10K-1608  [1608]
R77  12mΩ 1%  RES-V-KELVIN-0.012R-3216  [3216-KELVIN]
R78  10kΩ 0.1%  RES-V-10K-1608  [1608]
R79  12mΩ 1%  RES-V-KELVIN-0.012R-3216  [3216-KELVIN]
R80  10kΩ 0.1%  RES-V-10K-1608  [1608]
R81  12mΩ 1%  RES-V-KELVIN-0.012R-3216  [3216-KELVIN]
R82  10kΩ 0.1%  RES-V-10K-1608  [1608]
R83  12mΩ 1%  RES-V-KELVIN-0.012R-3216  [3216-KELVIN]
R85  10kΩ 0.1%  RES-V-10K-1608  [1608]
R86  12mΩ 1%  RES-V-KELVIN-0.012R-3216  [3216-KELVIN]
R87  10kΩ 0.1%  RES-V-10K-1608  [1608]
R88  12mΩ 1%  RES-V-KELVIN-0.012R-3216  [3216-KELVIN]
R89  10kΩ 0.1%  RES-V-10K-1608  [1608]
R90  12mΩ 1%  RES-V-KELVIN-0.012R-3216  [3216-KELVIN]
R91  10kΩ 0.1%  RES-V-10K-1608  [1608]
RT8  10kΩ 5%  THERMISTOR-H-10K-1608  [1608]
U33  INA199C2  [SOT363]
U36  INA199C2  [SOT363]
U37  INA199C2  [SOT363]
U38  INA199C2  [SOT363]
U39  INA199C2  [SOT363]
U43  INA199C2  [SOT363]
U44  INA199C2  [SOT363]
U45  INA199C2  [SOT363]
U46  INA199C2  [SOT363]
U47  INA199C2  [SOT363]
U48  INA199C2  [SOT363]
U50  INA199C2  [SOT363]
U51  INA199C2  [SOT363]

### Nets
3.3V [power]: R62.2 R63.2 R64.2 R65.2 R66.2 R68.2 R69.2 R72.2 R73.2 R74.2 R75.2 R76.2 R77.2 R78.2 R79.2 R80.2 R81.2 R82.2 R83.2 R85.2 R86.2 R87.2 R88.2 R89.2 R90.2 R91.2 ; also sheet 4,6,8,9,10,11,12
!PC_3.3V-0: Q42.4(G) Q43.6(A:D) R91.1
!PC_3.3V-1: Q41.4(G) Q43.3(B:D) R89.1
!PC_3.3V-2: Q39.4(G) Q40.6(A:D) R87.1
!PC_3.3V-3: Q38.4(G) Q40.3(B:D) R85.1
!PC_3.3V-4: Q36.4(G) Q37.6(A:D) R82.1
!PC_3.3V-5: Q35.4(G) Q37.3(B:D) R80.1 ; also sheet 9
!PC_3.3V-6: Q33.4(G) Q34.6(A:D) R78.1
!PC_3.3V-7: Q32.4(G) Q34.3(B:D) R76.1
!PC_3.3V-8: Q29.4(G) Q30.6(A:D) R74.1
!PC_3.3V-9: Q28.4(G) Q30.3(B:D) R72.1
!PC_3.3V-10: Q26.4(G) Q27.6(A:D) R68.1
!PC_3.3V-11: Q25.4(G) Q27.3(B:D) R65.1
!PC_3.3V-12: Q23.4(G) Q24.6(A:D) R63.1
AGND [power]: RT8.1 ; also sheet 2,4,5,6,8,11,12
AVDD [power]: U33.3(VDD) U36.3(VDD) U37.3(VDD) U38.3(VDD) U39.3(VDD) U43.3(VDD) U44.3(VDD) U45.3(VDD) U46.3(VDD) U47.3(VDD) U48.3(VDD) U50.3(VDD) U51.3(VDD) ; also sheet 5,6,8,10,11,12
I_3.3V-0: U51.6(OUT) ; also sheet 12
I_3.3V-0_N: R90.1-KELVIN U51.5(IN-)
I_3.3V-0_P: R90.2-KELVIN U51.4(IN+)
I_3.3V-1: U50.6(OUT) ; also sheet 12
I_3.3V-1_N: R88.1-KELVIN U50.5(IN-)
I_3.3V-1_P: R88.2-KELVIN U50.4(IN+)
I_3.3V-2: U48.6(OUT) ; also sheet 12
I_3.3V-2_N: R86.1-KELVIN U48.5(IN-)
I_3.3V-2_P: R86.2-KELVIN U48.4(IN+)
I_3.3V-3: U47.6(OUT) ; also sheet 12
I_3.3V-3_N: R83.1-KELVIN U47.5(IN-)
I_3.3V-3_P: R83.2-KELVIN U47.4(IN+)
I_3.3V-4: U46.6(OUT) ; also sheet 12
I_3.3V-4_N: R81.1-KELVIN U46.5(IN-)
I_3.3V-4_P: R81.2-KELVIN U46.4(IN+)
I_3.3V-5: U45.6(OUT) ; also sheet 12
I_3.3V-5_N: R79.1-KELVIN U45.5(IN-)
I_3.3V-5_P: R79.2-KELVIN U45.4(IN+)
I_3.3V-6: U44.6(OUT) ; also sheet 12
I_3.3V-6_N: R77.1-KELVIN U44.5(IN-)
I_3.3V-6_P: R77.2-KELVIN U44.4(IN+)
I_3.3V-7: U43.6(OUT) ; also sheet 12
I_3.3V-7_N: R75.1-KELVIN U43.5(IN-)
I_3.3V-7_P: R75.2-KELVIN U43.4(IN+)
I_3.3V-8: U39.6(OUT) ; also sheet 12
I_3.3V-8_N: R73.1-KELVIN U39.5(IN-)
I_3.3V-8_P: R73.2-KELVIN U39.4(IN+)
I_3.3V-9: U38.6(OUT) ; also sheet 12
I_3.3V-9_N: R69.1-KELVIN U38.5(IN-)
I_3.3V-9_P: R69.2-KELVIN U38.4(IN+)
I_3.3V-10: U37.6(OUT) ; also sheet 12
I_3.3V-10_N: R66.1-KELVIN U37.5(IN-)
I_3.3V-10_P: R66.2-KELVIN U37.4(IN+)
I_3.3V-11: U36.6(OUT) ; also sheet 12
I_3.3V-11_N: R64.1-KELVIN U36.5(IN-)
I_3.3V-11_P: R64.2-KELVIN U36.4(IN+)
I_3.3V-12: U33.6(OUT) ; also sheet 12
I_3.3V-12_N: R62.1-KELVIN U33.5(IN-)
I_3.3V-12_P: R62.2-KELVIN U33.4(IN+)
PC_3.3V-0: Q43.2(A:G) ; also sheet 9,10
PC_3.3V-1: Q43.5(B:G) ; also sheet 9,10
PC_3.3V-2: Q40.2(A:G) ; also sheet 9,10
PC_3.3V-3: Q40.5(B:G) ; also sheet 9,10
PC_3.3V-4: Q37.2(A:G) ; also sheet 9,10
PC_3.3V-5: Q37.5(B:G) ; also sheet 9,10
PC_3.3V-6: Q34.2(A:G) ; also sheet 9,10
PC_3.3V-7: Q34.5(B:G) ; also sheet 9,10
PC_3.3V-8: Q30.2(A:G) ; also sheet 9,10
PC_3.3V-9: Q30.5(B:G) ; also sheet 9,10
PC_3.3V-10: Q27.2(A:G) ; also sheet 9,10
PC_3.3V-11: Q27.5(B:G) ; also sheet 9,10
PC_3.3V-12: Q24.2(A:G) ; also sheet 9,10
PGND [power]: Q24.1(A:S) Q27.1(A:S) Q27.4(B:S) Q30.1(A:S) Q30.4(B:S) Q34.1(A:S) Q34.4(B:S) Q37.1(A:S) Q37.4(B:S) Q40.1(A:S) Q40.4(B:S) Q43.1(A:S) Q43.4(B:S) U33.1(REF) U33.2(GND) U36.1(REF) U36.2(GND) U37.1(REF) U37.2(GND) U38.1(REF) U38.2(GND) U39.1(REF) U39.2(GND) U43.1(REF) U43.2(GND) U44.1(REF) U44.2(GND) U45.1(REF) U45.2(GND) U46.1(REF) U46.2(GND) U47.1(REF) U47.2(GND) U48.1(REF) U48.2(GND) U50.1(REF) U50.2(GND) U51.1(REF) U51.2(GND) ; also sheet 2,4,5,6,8,9,12
PR_3.3V-0 [power]: Q42.1(D) Q42.2(D) Q42.3(D) ; also sheet 9,10
PR_3.3V-1 [power]: Q41.1(D) Q41.2(D) Q41.3(D) ; also sheet 9
PR_3.3V-2 [power]: Q39.1(D) Q39.2(D) Q39.3(D) ; also sheet 9
PR_3.3V-3 [power]: Q38.1(D) Q38.2(D) Q38.3(D) ; also sheet 9
PR_3.3V-4 [power]: Q36.1(D) Q36.2(D) Q36.3(D) ; also sheet 9
PR_3.3V-5 [power]: Q35.1(D) Q35.2(D) Q35.3(D) ; also sheet 9
PR_3.3V-6 [power]: Q33.1(D) Q33.2(D) Q33.3(D) ; also sheet 9
PR_3.3V-7 [power]: Q32.1(D) Q32.2(D) Q32.3(D) ; also sheet 9
PR_3.3V-8 [power]: Q29.1(D) Q29.2(D) Q29.3(D) ; also sheet 9
PR_3.3V-9 [power]: Q28.1(D) Q28.2(D) Q28.3(D) ; also sheet 9
PR_3.3V-10 [power]: Q26.1(D) Q26.2(D) Q26.3(D) ; also sheet 9
PR_3.3V-11 [power]: Q25.1(D) Q25.2(D) Q25.3(D) ; also sheet 9
PR_3.3V-12 [power]: Q23.1(D) Q23.2(D) Q23.3(D) ; also sheet 9
PR_FET_3.3V-0 [power]: Q42.5(S) Q42.6(S) Q42.7(S) Q42.8(S) Q42.PAD(S) R90.1
PR_FET_3.3V-1 [power]: Q41.5(S) Q41.6(S) Q41.7(S) Q41.8(S) Q41.PAD(S) R88.1
PR_FET_3.3V-2 [power]: Q39.5(S) Q39.6(S) Q39.7(S) Q39.8(S) Q39.PAD(S) R86.1
PR_FET_3.3V-3 [power]: Q38.5(S) Q38.6(S) Q38.7(S) Q38.8(S) Q38.PAD(S) R83.1
PR_FET_3.3V-4 [power]: Q36.5(S) Q36.6(S) Q36.7(S) Q36.8(S) Q36.PAD(S) R81.1
PR_FET_3.3V-5 [power]: Q35.5(S) Q35.6(S) Q35.7(S) Q35.8(S) Q35.PAD(S) R79.1
PR_FET_3.3V-6 [power]: Q33.5(S) Q33.6(S) Q33.7(S) Q33.8(S) Q33.PAD(S) R77.1
PR_FET_3.3V-7 [power]: Q32.5(S) Q32.6(S) Q32.7(S) Q32.8(S) Q32.PAD(S) R75.1
PR_FET_3.3V-8 [power]: Q29.5(S) Q29.6(S) Q29.7(S) Q29.8(S) Q29.PAD(S) R73.1
PR_FET_3.3V-9 [power]: Q28.5(S) Q28.6(S) Q28.7(S) Q28.8(S) Q28.PAD(S) R69.1
PR_FET_3.3V-10 [power]: Q26.5(S) Q26.6(S) Q26.7(S) Q26.8(S) Q26.PAD(S) R66.1
PR_FET_3.3V-11 [power]: Q25.5(S) Q25.6(S) Q25.7(S) Q25.8(S) Q25.PAD(S) R64.1
PR_FET_3.3V-12 [power]: Q23.5(S) Q23.6(S) Q23.7(S) Q23.8(S) Q23.PAD(S) R62.1
TEMP-OUT_SW-0: RT8.2 ; also sheet 12

### Notes on the sheet
- 10A1> | 10A1> | 10A1>
- 9A3> | 9A3> | 9A3>
- 12A1> | 12A1> | 12A1>
- 0-2.08A=509µA/LSB | 0-2.08A=509µA/LSB | 0-2.08A=509µA/LSB
- 9B2>
- 10A1> | 10D1> | 10D1>
- 9A3> | 9A3> | 9A3>
- 12A1> | 12A1> | 12A1>
- 0-2.08A=509µA/LSB | 0-2.08A=509µA/LSB | 0-2.08A=509µA/LSB
- 10C1> | 10C1> | 10C1>
- 9A3> | 9A3> | 9A3>
- 12A1> | 12A1> | 12B1>
- 0-2.08A=509µA/LSB | 0-2.08A=509µA/LSB | 0-2.08A=509µA/LSB
- 10C1> | 10C1> | 10C1>
- 9B3> | 9B3> | 9B3>
- 12B1> | 12B1> | 12B1>
- 0-2.08A=509µA/LSB | 0-2.08A=509µA/LSB | 0-2.08A=509µA/LSB
- 11B4>
- 10B1>
- 9B3>
- 12B1>
- 0-2.08A=509µA/LSB

## Sheet 8 of 13
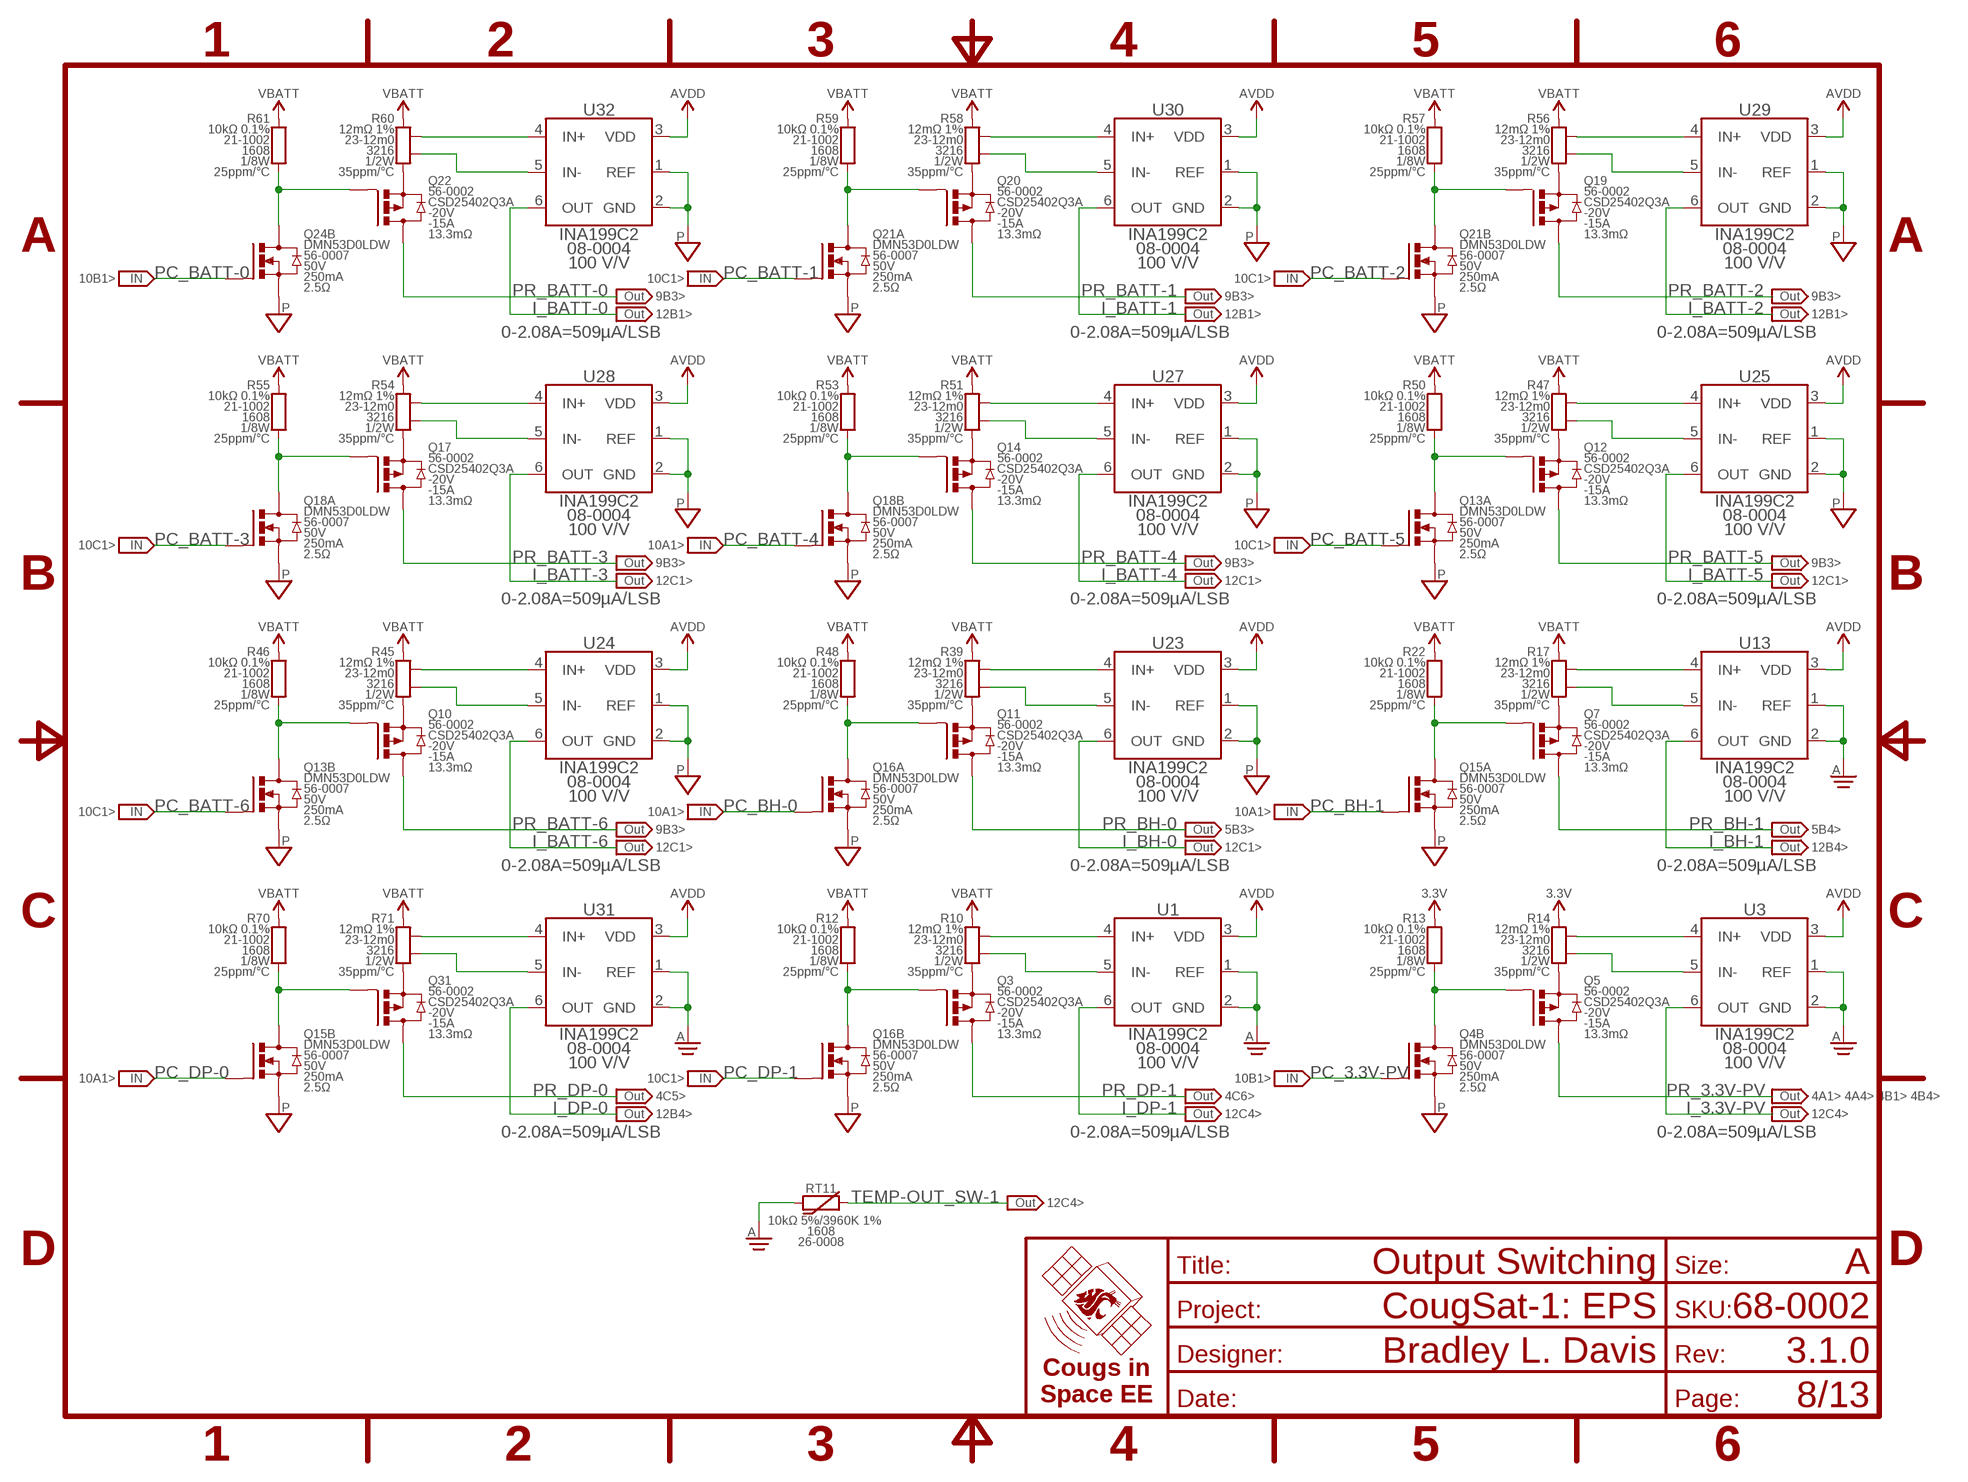
[diagram p7: schematic, sheet 8]
FRAME10 (FRAME-A): TITLE: Output Switching

### Parts
Q3  CSD25402Q3A  MOSFET-P-SON-3333  [SON-3333]
Q4  DMN53D0LDW  MOSFET_DUAL-N-DMN53D0LDW-SOT363  [SOT363]
Q5  CSD25402Q3A  MOSFET-P-SON-3333  [SON-3333]
Q7  CSD25402Q3A  MOSFET-P-SON-3333  [SON-3333]
Q10  CSD25402Q3A  MOSFET-P-SON-3333  [SON-3333]
Q11  CSD25402Q3A  MOSFET-P-SON-3333  [SON-3333]
Q12  CSD25402Q3A  MOSFET-P-SON-3333  [SON-3333]
Q13  DMN53D0LDW  MOSFET_DUAL-N-DMN53D0LDW-SOT363  [SOT363]
Q14  CSD25402Q3A  MOSFET-P-SON-3333  [SON-3333]
Q15  DMN53D0LDW  MOSFET_DUAL-N-DMN53D0LDW-SOT363  [SOT363]
Q16  DMN53D0LDW  MOSFET_DUAL-N-DMN53D0LDW-SOT363  [SOT363]
Q17  CSD25402Q3A  MOSFET-P-SON-3333  [SON-3333]
Q18  DMN53D0LDW  MOSFET_DUAL-N-DMN53D0LDW-SOT363  [SOT363]
Q19  CSD25402Q3A  MOSFET-P-SON-3333  [SON-3333]
Q20  CSD25402Q3A  MOSFET-P-SON-3333  [SON-3333]
Q21  DMN53D0LDW  MOSFET_DUAL-N-DMN53D0LDW-SOT363  [SOT363]
Q22  CSD25402Q3A  MOSFET-P-SON-3333  [SON-3333]
Q31  CSD25402Q3A  MOSFET-P-SON-3333  [SON-3333]
R10  12mΩ 1%  RES-V-KELVIN-0.012R-3216  [3216-KELVIN]
R12  10kΩ 0.1%  RES-V-10K-1608  [1608]
R13  10kΩ 0.1%  RES-V-10K-1608  [1608]
R14  12mΩ 1%  RES-V-KELVIN-0.012R-3216  [3216-KELVIN]
R17  12mΩ 1%  RES-V-KELVIN-0.012R-3216  [3216-KELVIN]
R22  10kΩ 0.1%  RES-V-10K-1608  [1608]
R39  12mΩ 1%  RES-V-KELVIN-0.012R-3216  [3216-KELVIN]
R45  12mΩ 1%  RES-V-KELVIN-0.012R-3216  [3216-KELVIN]
R46  10kΩ 0.1%  RES-V-10K-1608  [1608]
R47  12mΩ 1%  RES-V-KELVIN-0.012R-3216  [3216-KELVIN]
R48  10kΩ 0.1%  RES-V-10K-1608  [1608]
R50  10kΩ 0.1%  RES-V-10K-1608  [1608]
R51  12mΩ 1%  RES-V-KELVIN-0.012R-3216  [3216-KELVIN]
R53  10kΩ 0.1%  RES-V-10K-1608  [1608]
R54  12mΩ 1%  RES-V-KELVIN-0.012R-3216  [3216-KELVIN]
R55  10kΩ 0.1%  RES-V-10K-1608  [1608]
R56  12mΩ 1%  RES-V-KELVIN-0.012R-3216  [3216-KELVIN]
R57  10kΩ 0.1%  RES-V-10K-1608  [1608]
R58  12mΩ 1%  RES-V-KELVIN-0.012R-3216  [3216-KELVIN]
R59  10kΩ 0.1%  RES-V-10K-1608  [1608]
R60  12mΩ 1%  RES-V-KELVIN-0.012R-3216  [3216-KELVIN]
R61  10kΩ 0.1%  RES-V-10K-1608  [1608]
R70  10kΩ 0.1%  RES-V-10K-1608  [1608]
R71  12mΩ 1%  RES-V-KELVIN-0.012R-3216  [3216-KELVIN]
RT11  10kΩ 5%  THERMISTOR-H-10K-1608  [1608]
U1  INA199C2  [SOT363]
U3  INA199C2  [SOT363]
U13  INA199C2  [SOT363]
U23  INA199C2  [SOT363]
U24  INA199C2  [SOT363]
U25  INA199C2  [SOT363]
U27  INA199C2  [SOT363]
U28  INA199C2  [SOT363]
U29  INA199C2  [SOT363]
U30  INA199C2  [SOT363]
U31  INA199C2  [SOT363]
U32  INA199C2  [SOT363]

### Nets
3.3V [power]: R13.2 R14.2 ; also sheet 4,6,7,9,10,11,12
!PC_3.3V-PV: Q4.3(B:D) Q5.4(G) R13.1
!PC_BATT-0: Q22.4(G) Q24.3(B:D) R61.1
!PC_BATT-1: Q20.4(G) Q21.6(A:D) R59.1
!PC_BATT-2: Q19.4(G) Q21.3(B:D) R57.1
!PC_BATT-3: Q17.4(G) Q18.6(A:D) R55.1
!PC_BATT-4: Q14.4(G) Q18.3(B:D) R53.1
!PC_BATT-5: Q12.4(G) Q13.6(A:D) R50.1
!PC_BATT-6: Q10.4(G) Q13.3(B:D) R46.1
!PC_BH-0: Q11.4(G) Q16.6(A:D) R48.1
!PC_BH-1: Q7.4(G) Q15.6(A:D) R22.1
!PC_DP-0: Q15.3(B:D) Q31.4(G) R70.1
!PC_DP-1: Q3.4(G) Q16.3(B:D) R12.1
AGND [power]: RT11.1 U1.1(REF) U1.2(GND) U3.1(REF) U3.2(GND) U13.1(REF) U13.2(GND) U31.1(REF) U31.2(GND) ; also sheet 2,4,5,6,7,11,12
AVDD [power]: U1.3(VDD) U3.3(VDD) U13.3(VDD) U23.3(VDD) U24.3(VDD) U25.3(VDD) U27.3(VDD) U28.3(VDD) U29.3(VDD) U30.3(VDD) U31.3(VDD) U32.3(VDD) ; also sheet 5,6,7,10,11,12
I_3.3V-PV: U3.6(OUT) ; also sheet 12
I_3.3V-PV_N: R14.1-KELVIN U3.5(IN-)
I_3.3V-PV_P: R14.2-KELVIN U3.4(IN+)
I_BATT-0: U32.6(OUT) ; also sheet 12
I_BATT-0_N: R60.1-KELVIN U32.5(IN-)
I_BATT-0_P: R60.2-KELVIN U32.4(IN+)
I_BATT-1: U30.6(OUT) ; also sheet 12
I_BATT-1_N: R58.1-KELVIN U30.5(IN-)
I_BATT-1_P: R58.2-KELVIN U30.4(IN+)
I_BATT-2: U29.6(OUT) ; also sheet 12
I_BATT-2_N: R56.1-KELVIN U29.5(IN-)
I_BATT-2_P: R56.2-KELVIN U29.4(IN+)
I_BATT-3: U28.6(OUT) ; also sheet 12
I_BATT-3_N: R54.1-KELVIN U28.5(IN-)
I_BATT-3_P: R54.2-KELVIN U28.4(IN+)
I_BATT-4: U27.6(OUT) ; also sheet 12
I_BATT-4_N: R51.1-KELVIN U27.5(IN-)
I_BATT-4_P: R51.2-KELVIN U27.4(IN+)
I_BATT-5: U25.6(OUT) ; also sheet 12
I_BATT-5_N: R47.1-KELVIN U25.5(IN-)
I_BATT-5_P: R47.2-KELVIN U25.4(IN+)
I_BATT-6: U24.6(OUT) ; also sheet 12
I_BATT-6_N: R45.1-KELVIN U24.5(IN-)
I_BATT-6_P: R45.2-KELVIN U24.4(IN+)
I_BH-0: U23.6(OUT) ; also sheet 12
I_BH-0_N: R39.1-KELVIN U23.5(IN-)
I_BH-0_P: R39.2-KELVIN U23.4(IN+)
I_BH-1: U13.6(OUT) ; also sheet 12
I_BH-1_N: R17.1-KELVIN U13.5(IN-)
I_BH-1_P: R17.2-KELVIN U13.4(IN+)
I_DP-0: U31.6(OUT) ; also sheet 12
I_DP-0_N: R71.1-KELVIN U31.5(IN-)
I_DP-0_P: R71.2-KELVIN U31.4(IN+)
I_DP-1: U1.6(OUT) ; also sheet 12
I_DP-1_N: R10.1-KELVIN U1.5(IN-)
I_DP-1_P: R10.2-KELVIN U1.4(IN+)
PC_3.3V-PV: Q4.5(B:G) ; also sheet 9,10
PC_BATT-0: Q24.5(B:G) ; also sheet 9,10
PC_BATT-1: Q21.2(A:G) ; also sheet 9,10
PC_BATT-2: Q21.5(B:G) ; also sheet 9,10
PC_BATT-3: Q18.2(A:G) ; also sheet 9,10
PC_BATT-4: Q18.5(B:G) ; also sheet 9,10
PC_BATT-5: Q13.2(A:G) ; also sheet 9,10
PC_BATT-6: Q13.5(B:G) ; also sheet 9,10
PC_BH-0: Q16.2(A:G) ; also sheet 9,10
PC_BH-1: Q15.2(A:G) ; also sheet 9,10
PC_DP-0: Q15.5(B:G) ; also sheet 9,10
PC_DP-1: Q16.5(B:G) ; also sheet 9,10
PGND [power]: Q4.4(B:S) Q13.1(A:S) Q13.4(B:S) Q15.1(A:S) Q15.4(B:S) Q16.1(A:S) Q16.4(B:S) Q18.1(A:S) Q18.4(B:S) Q21.1(A:S) Q21.4(B:S) Q24.4(B:S) U23.1(REF) U23.2(GND) U24.1(REF) U24.2(GND) U25.1(REF) U25.2(GND) U27.1(REF) U27.2(GND) U28.1(REF) U28.2(GND) U29.1(REF) U29.2(GND) U30.1(REF) U30.2(GND) U32.1(REF) U32.2(GND) ; also sheet 2,4,5,6,7,9,12
PR_3.3V-PV [power]: Q5.1(D) Q5.2(D) Q5.3(D) ; also sheet 4,10
PR_BATT-0 [power]: Q22.1(D) Q22.2(D) Q22.3(D) ; also sheet 9
PR_BATT-1 [power]: Q20.1(D) Q20.2(D) Q20.3(D) ; also sheet 9
PR_BATT-2 [power]: Q19.1(D) Q19.2(D) Q19.3(D) ; also sheet 9
PR_BATT-3 [power]: Q17.1(D) Q17.2(D) Q17.3(D) ; also sheet 9
PR_BATT-4 [power]: Q14.1(D) Q14.2(D) Q14.3(D) ; also sheet 9
PR_BATT-5 [power]: Q12.1(D) Q12.2(D) Q12.3(D) ; also sheet 9
PR_BATT-6 [power]: Q10.1(D) Q10.2(D) Q10.3(D) ; also sheet 9
PR_BH-0 [power]: Q11.1(D) Q11.2(D) Q11.3(D) ; also sheet 5
PR_BH-1 [power]: Q7.1(D) Q7.2(D) Q7.3(D) ; also sheet 5
PR_DP-0 [power]: Q31.1(D) Q31.2(D) Q31.3(D) ; also sheet 4
PR_DP-1 [power]: Q3.1(D) Q3.2(D) Q3.3(D) ; also sheet 4
PR_FET_3.3V-21 [power]: Q31.5(S) Q31.6(S) Q31.7(S) Q31.8(S) Q31.PAD(S) R71.1
PR_FET_3.3V-22 [power]: Q3.5(S) Q3.6(S) Q3.7(S) Q3.8(S) Q3.PAD(S) R10.1
PR_FET_3.3V-PV [power]: Q5.5(S) Q5.6(S) Q5.7(S) Q5.8(S) Q5.PAD(S) R14.1
PR_FET_BATT-0 [power]: Q22.5(S) Q22.6(S) Q22.7(S) Q22.8(S) Q22.PAD(S) R60.1
PR_FET_BATT-1 [power]: Q20.5(S) Q20.6(S) Q20.7(S) Q20.8(S) Q20.PAD(S) R58.1
PR_FET_BATT-2 [power]: Q19.5(S) Q19.6(S) Q19.7(S) Q19.8(S) Q19.PAD(S) R56.1
PR_FET_BATT-3 [power]: Q17.5(S) Q17.6(S) Q17.7(S) Q17.8(S) Q17.PAD(S) R54.1
PR_FET_BATT-4 [power]: Q14.5(S) Q14.6(S) Q14.7(S) Q14.8(S) Q14.PAD(S) R51.1
PR_FET_BATT-5 [power]: Q12.5(S) Q12.6(S) Q12.7(S) Q12.8(S) Q12.PAD(S) R47.1
PR_FET_BATT-6 [power]: Q10.5(S) Q10.6(S) Q10.7(S) Q10.8(S) Q10.PAD(S) R45.1
PR_FET_BH-0 [power]: Q11.5(S) Q11.6(S) Q11.7(S) Q11.8(S) Q11.PAD(S) R39.1
PR_FET_BH-1 [power]: Q7.5(S) Q7.6(S) Q7.7(S) Q7.8(S) Q7.PAD(S) R17.1
TEMP-OUT_SW-1: RT11.2 ; also sheet 12
VBATT [power]: R10.2 R12.2 R17.2 R22.2 R39.2 R45.2 R46.2 R47.2 R48.2 R50.2 R51.2 R53.2 R54.2 R55.2 R56.2 R57.2 R58.2 R59.2 R60.2 R61.2 R70.2 R71.2 ; also sheet 5,6
Unconnected: Q4.1(A:S) Q4.2(A:G) Q4.6(A:D)

### Notes on the sheet
- 10B1> | 10C1> | 10C1>
- 9B3> | 9B3> | 9B3>
- 12B1> | 12B1> | 12B1>
- 0-2.08A=509µA/LSB | 0-2.08A=509µA/LSB | 0-2.08A=509µA/LSB
- 10C1> | 10A1> | 10C1>
- 9B3> | 9B3> | 9B3>
- 12C1> | 12C1> | 12C1>
- 0-2.08A=509µA/LSB | 0-2.08A=509µA/LSB | 0-2.08A=509µA/LSB
- 10C1> | 10A1> | 10A1>
- 9B3> | 5B3> | 5B4>
- 12C1> | 12C1> | 12B4>
- 0-2.08A=509µA/LSB | 0-2.08A=509µA/LSB | 0-2.08A=509µA/LSB
- 10A1> | 10C1> | 10B1>
- 4C5> | 4C6> | 4A1> 4A4> 4B1> 4B4>
- 12B4> | 12C4> | 12C4>
- 0-2.08A=509µA/LSB | 0-2.08A=509µA/LSB | 0-2.08A=509µA/LSB
- 12C4>

## Sheet 9 of 13
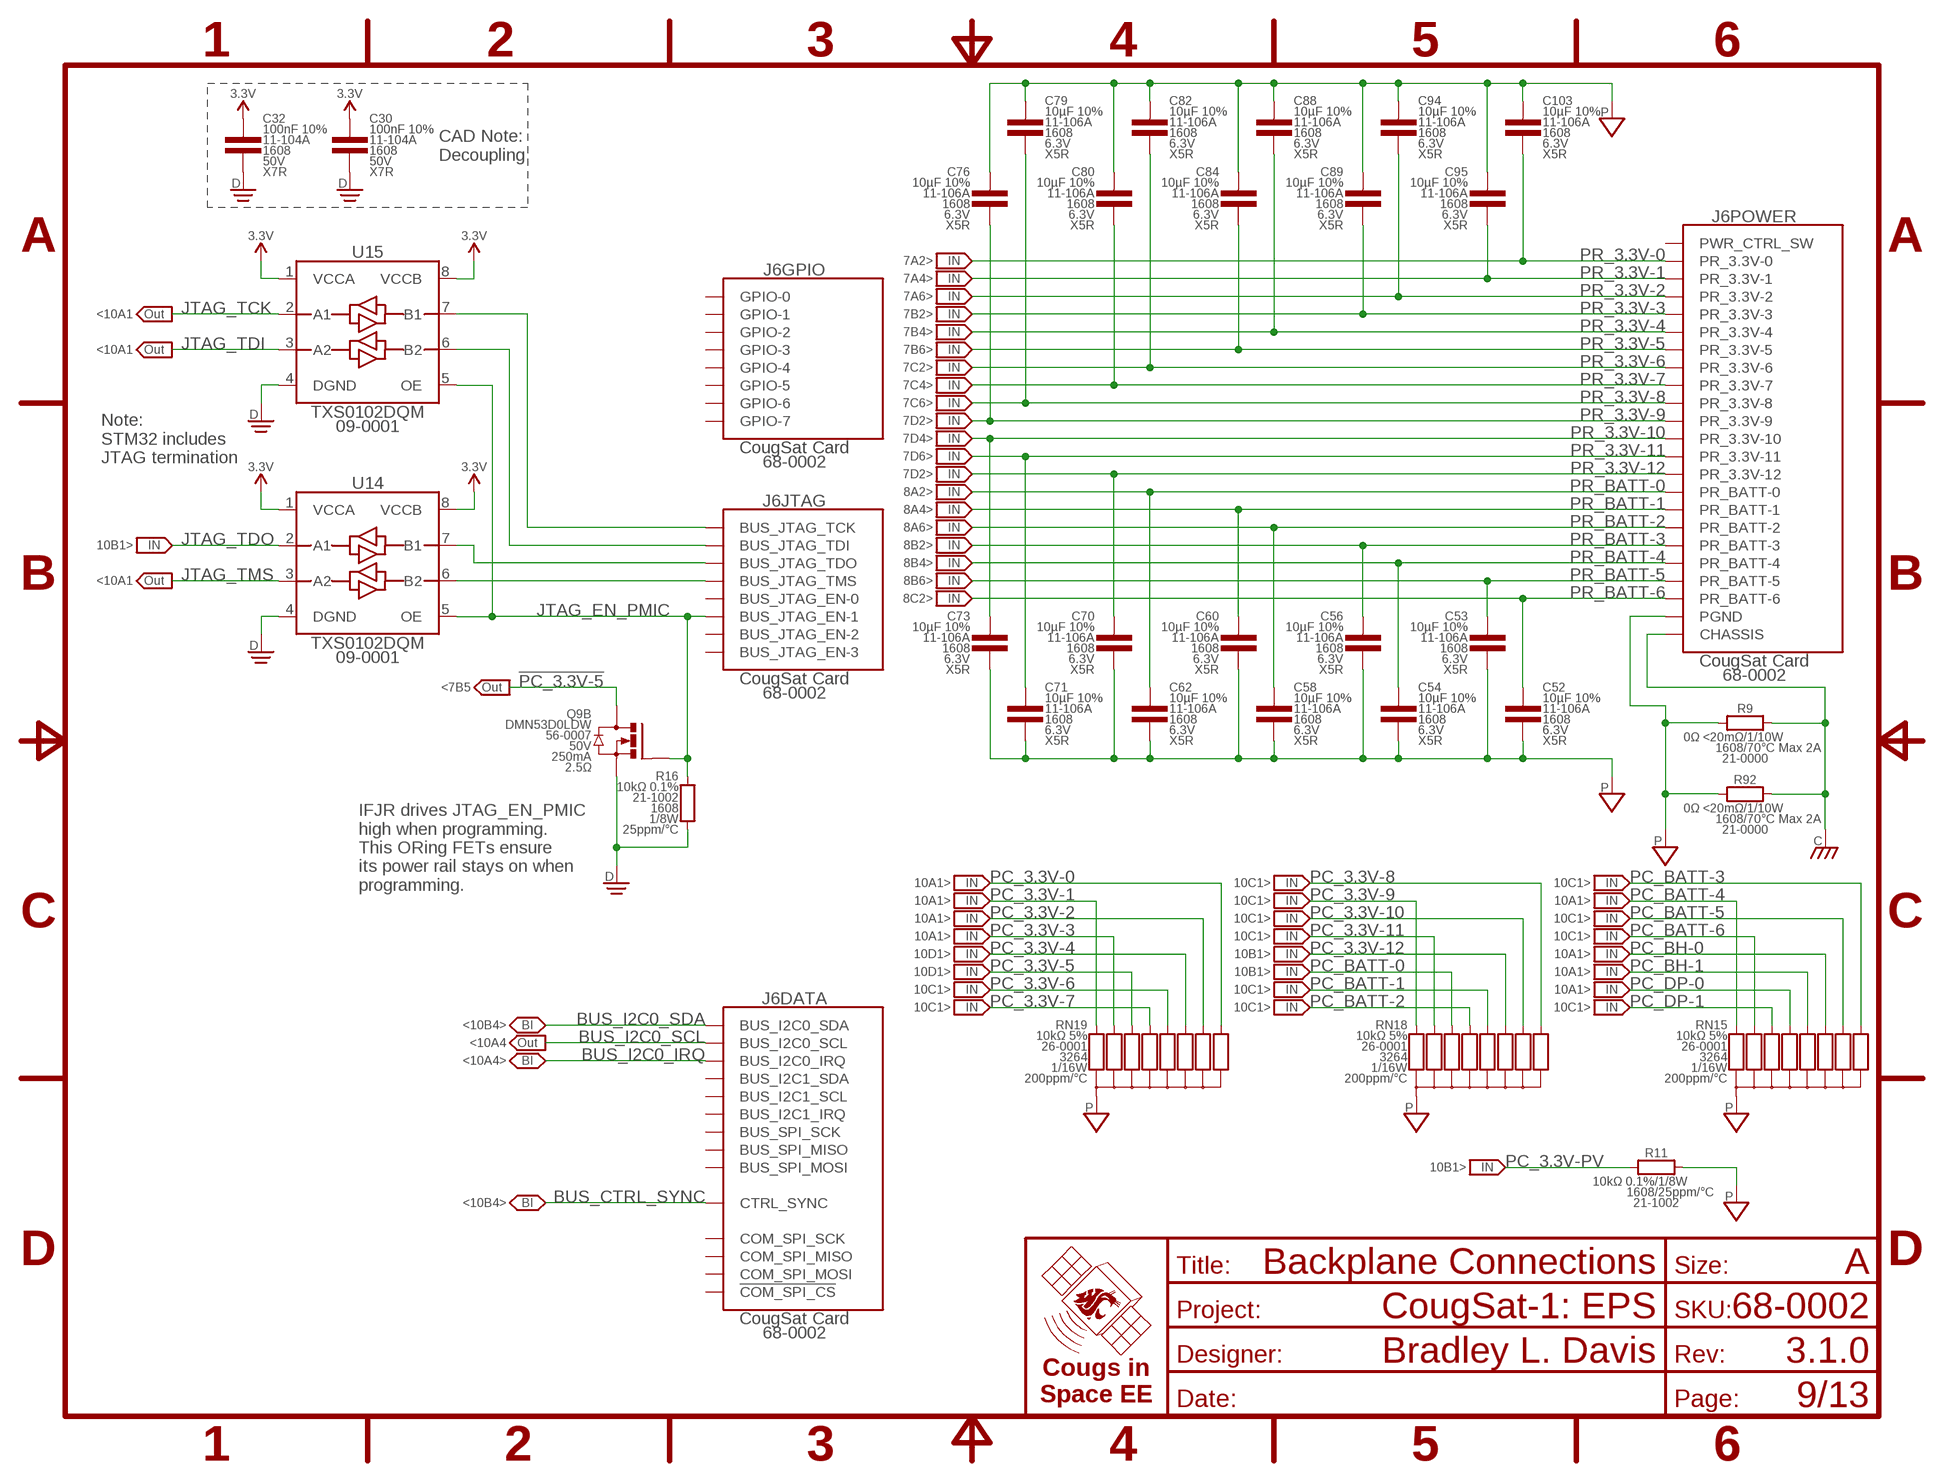
[diagram p8: schematic, sheet 9]
FRAME13 (FRAME-A): TITLE: Backplane Connections

### Parts
C30  100nF 10%  CAP-V-100NF-1608  [1608]
C32  100nF 10%  CAP-V-100NF-1608  [1608]
C52  10µF 10%  CAP-V-10UF-1608  [1608]
C53  10µF 10%  CAP-V-10UF-1608  [1608]
C54  10µF 10%  CAP-V-10UF-1608  [1608]
C56  10µF 10%  CAP-V-10UF-1608  [1608]
C58  10µF 10%  CAP-V-10UF-1608  [1608]
C60  10µF 10%  CAP-V-10UF-1608  [1608]
C62  10µF 10%  CAP-V-10UF-1608  [1608]
C70  10µF 10%  CAP-V-10UF-1608  [1608]
C71  10µF 10%  CAP-V-10UF-1608  [1608]
C73  10µF 10%  CAP-V-10UF-1608  [1608]
C76  10µF 10%  CAP-V-10UF-1608  [1608]
C79  10µF 10%  CAP-V-10UF-1608  [1608]
C80  10µF 10%  CAP-V-10UF-1608  [1608]
C82  10µF 10%  CAP-V-10UF-1608  [1608]
C84  10µF 10%  CAP-V-10UF-1608  [1608]
C88  10µF 10%  CAP-V-10UF-1608  [1608]
C89  10µF 10%  CAP-V-10UF-1608  [1608]
C94  10µF 10%  CAP-V-10UF-1608  [1608]
C95  10µF 10%  CAP-V-10UF-1608  [1608]
C103  10µF 10%  CAP-V-10UF-1608  [1608]
J6  CougSat Card  CIS_CARD-OPEN+X  [CARD-FULL-OPEN+X]
Q9  DMN53D0LDW  MOSFET_DUAL-N-DMN53D0LDW-SOT363  [SOT363]
R9  0Ω <20mΩ  RES-H-0-1608  [1608]
R11  10kΩ 0.1%  RES-H-10K-1608  [1608]
R16  10kΩ 0.1%  RES-V-10K-1608  [1608]
R92  0Ω <20mΩ  RES-H-0-1608  [1608]
RN15  10kΩ 5%  RES_BUS-10-10K-3264  [3264]
RN18  10kΩ 5%  RES_BUS-10-10K-3264  [3264]
RN19  10kΩ 5%  RES_BUS-10-10K-3264  [3264]
U14  TXS0102DQM  LEVEL_SHIFTER-2BIT-XSON-8  [X2SON-8]
U15  TXS0102DQM  LEVEL_SHIFTER-2BIT-XSON-8  [X2SON-8]

### Nets
3.3V [power]: C30.1 C32.1 U14.1(VCCA) U14.8(VCCB) U15.1(VCCA) U15.8(VCCB) ; also sheet 4,6,7,8,10,11,12
!PC_3.3V-5: Q9.3(B:D) ; also sheet 7
BUS_CTRL_SYNC: J6.A42(DATA:CTRL_SYNC) J6.B42(DATA:CTRL_SYNC) ; also sheet 10
BUS_I2C0_IRQ: J6.A45(DATA:BUS_I2C0_IRQ) J6.B45(DATA:BUS_I2C0_IRQ) ; also sheet 10
BUS_I2C0_SCL: J6.A44(DATA:BUS_I2C0_SCL) J6.B44(DATA:BUS_I2C0_SCL) ; also sheet 10
BUS_I2C0_SDA: J6.A43(DATA:BUS_I2C0_SDA) J6.B43(DATA:BUS_I2C0_SDA) ; also sheet 10
BUS_JTAG_TCK: J6.A46(JTAG:BUS_JTAG_TCK) U15.7(B1)
BUS_JTAG_TDI: J6.A47(JTAG:BUS_JTAG_TDI) U15.6(B2)
BUS_JTAG_TDO: J6.A48(JTAG:BUS_JTAG_TDO) U14.7(B1)
BUS_JTAG_TMS: J6.A49(JTAG:BUS_JTAG_TMS) U14.6(B2)
CHASSIS [power]: J6.CHASSIS@1(POWER:CHASSIS) J6.CHASSIS@2(POWER:CHASSIS) J6.CHASSIS@3(POWER:CHASSIS) J6.CHASSIS@4(POWER:CHASSIS) R9.2 R92.2
DGND [power]: C30.2 C32.2 Q9.4(B:S) R16.1 U14.4(DGND) U15.4(DGND) ; also sheet 2,10,11,12
JTAG_EN_PMIC: J6.B47(JTAG:BUS_JTAG_EN-1) Q9.5(B:G) R16.2 U14.5(OE) U15.5(OE)
JTAG_TCK: U15.2(A1) ; also sheet 10
JTAG_TDI: U15.3(A2) ; also sheet 10
JTAG_TDO: U14.2(A1) ; also sheet 10
JTAG_TMS: U14.3(A2) ; also sheet 10
PC_3.3V-0: RN19.9 ; also sheet 7,10
PC_3.3V-1: RN19.1 ; also sheet 7,10
PC_3.3V-2: RN19.8 ; also sheet 7,10
PC_3.3V-3: RN19.2 ; also sheet 7,10
PC_3.3V-4: RN19.7 ; also sheet 7,10
PC_3.3V-5: RN19.3 ; also sheet 7,10
PC_3.3V-6: RN19.6 ; also sheet 7,10
PC_3.3V-7: RN19.4 ; also sheet 7,10
PC_3.3V-8: RN18.9 ; also sheet 7,10
PC_3.3V-9: RN18.1 ; also sheet 7,10
PC_3.3V-10: RN18.8 ; also sheet 7,10
PC_3.3V-11: RN18.2 ; also sheet 7,10
PC_3.3V-12: RN18.7 ; also sheet 7,10
PC_3.3V-PV: R11.1 ; also sheet 8,10
PC_BATT-0: RN18.3 ; also sheet 8,10
PC_BATT-1: RN18.6 ; also sheet 8,10
PC_BATT-2: RN18.4 ; also sheet 8,10
PC_BATT-3: RN15.9 ; also sheet 8,10
PC_BATT-4: RN15.1 ; also sheet 8,10
PC_BATT-5: RN15.8 ; also sheet 8,10
PC_BATT-6: RN15.2 ; also sheet 8,10
PC_BH-0: RN15.7 ; also sheet 8,10
PC_BH-1: RN15.6 ; also sheet 8,10
PC_DP-0: RN15.4 ; also sheet 8,10
PC_DP-1: RN15.3 ; also sheet 8,10
PGND [power]: C52.2 C53.2 C54.2 C56.2 C58.2 C60.2 C62.2 C70.2 C71.2 C73.2 C76.1 C79.1 C80.1 C82.1 C84.1 C88.1 C89.1 C94.1 C95.1 C103.1 J6.A21(POWER:PGND) J6.A22(POWER:PGND) J6.A23(POWER:PGND) J6.B21(POWER:PGND) J6.B22(POWER:PGND) J6.B23(POWER:PGND) J6.B24(POWER:PGND) J6.B25(POWER:PGND) J6.B26(POWER:PGND) J6.B27(POWER:PGND) J6.B28(POWER:PGND) J6.B29(POWER:PGND) R9.1 R11.2 R92.1 RN15.5(C) RN15.10(C) RN18.5(C) RN18.10(C) RN19.5(C) RN19.10(C) ; also sheet 2,4,5,6,7,8,12
PR_3.3V-0 [power]: C103.2 J6.A1(POWER:PR_3.3V-0) J6.B1(POWER:PR_3.3V-0) ; also sheet 7,10
PR_3.3V-1 [power]: C95.2 J6.A2(POWER:PR_3.3V-1) J6.B2(POWER:PR_3.3V-1) ; also sheet 7
PR_3.3V-2 [power]: C94.2 J6.A3(POWER:PR_3.3V-2) J6.B3(POWER:PR_3.3V-2) ; also sheet 7
PR_3.3V-3 [power]: C89.2 J6.A4(POWER:PR_3.3V-3) J6.B4(POWER:PR_3.3V-3) ; also sheet 7
PR_3.3V-4 [power]: C88.2 J6.A5(POWER:PR_3.3V-4) J6.B5(POWER:PR_3.3V-4) ; also sheet 7
PR_3.3V-5 [power]: C84.2 J6.A6(POWER:PR_3.3V-5) J6.B6(POWER:PR_3.3V-5) ; also sheet 7
PR_3.3V-6 [power]: C82.2 J6.A7(POWER:PR_3.3V-6) J6.B7(POWER:PR_3.3V-6) ; also sheet 7
PR_3.3V-7 [power]: C80.2 J6.A8(POWER:PR_3.3V-7) J6.B8(POWER:PR_3.3V-7) ; also sheet 7
PR_3.3V-8 [power]: C79.2 J6.A9(POWER:PR_3.3V-8) J6.B9(POWER:PR_3.3V-8) ; also sheet 7
PR_3.3V-9 [power]: C76.2 J6.A10(POWER:PR_3.3V-9) J6.B10(POWER:PR_3.3V-9) ; also sheet 7
PR_3.3V-10 [power]: C73.1 J6.A11(POWER:PR_3.3V-10) J6.B11(POWER:PR_3.3V-10) ; also sheet 7
PR_3.3V-11 [power]: C71.1 J6.A12(POWER:PR_3.3V-11) J6.B12(POWER:PR_3.3V-11) ; also sheet 7
PR_3.3V-12 [power]: C70.1 J6.A13(POWER:PR_3.3V-12) J6.B13(POWER:PR_3.3V-12) ; also sheet 7
PR_BATT-0 [power]: C62.1 J6.A14(POWER:PR_BATT-0) J6.B14(POWER:PR_BATT-0) ; also sheet 8
PR_BATT-1 [power]: C60.1 J6.A15(POWER:PR_BATT-1) J6.B15(POWER:PR_BATT-1) ; also sheet 8
PR_BATT-2 [power]: C58.1 J6.A16(POWER:PR_BATT-2) J6.B16(POWER:PR_BATT-2) ; also sheet 8
PR_BATT-3 [power]: C56.1 J6.A17(POWER:PR_BATT-3) J6.B17(POWER:PR_BATT-3) ; also sheet 8
PR_BATT-4 [power]: C54.1 J6.A18(POWER:PR_BATT-4) J6.B18(POWER:PR_BATT-4) ; also sheet 8
PR_BATT-5 [power]: C53.1 J6.A19(POWER:PR_BATT-5) J6.B19(POWER:PR_BATT-5) ; also sheet 8
PR_BATT-6 [power]: C52.1 J6.A20(POWER:PR_BATT-6) J6.B20(POWER:PR_BATT-6) ; also sheet 8
Unconnected: J6.A24(GPIO:GPIO-0) J6.A25(GPIO:GPIO-1) J6.A26(GPIO:GPIO-2) J6.A27(GPIO:GPIO-3) J6.A28(GPIO:GPIO-4) J6.A29(GPIO:GPIO-5) J6.A30(DATA:BUS_I2C1_SDA) J6.A31(DATA:BUS_I2C1_SCL) J6.A32(DATA:BUS_I2C1_IRQ) J6.A33(DATA:COM_SPI_SCK) J6.A34(DATA:COM_SPI_MISO) J6.A35(DATA:COM_SPI_MOSI) J6.A36(DATA:!COM_SPI_CS) J6.A37(DATA:BUS_SPI_SCK) J6.A38(DATA:BUS_SPI_MISO) J6.A39(DATA:BUS_SPI_MOSI) J6.A40(POWER:PWR_CTRL_SW) J6.A41(GPIO:GPIO-6) J6.B30(DATA:BUS_I2C1_SDA) J6.B31(DATA:BUS_I2C1_SCL) J6.B32(DATA:BUS_I2C1_IRQ) J6.B33(DATA:COM_SPI_SCK) J6.B34(DATA:COM_SPI_MISO) J6.B35(DATA:COM_SPI_MOSI) J6.B36(DATA:!COM_SPI_CS) J6.B37(DATA:BUS_SPI_SCK) J6.B38(DATA:BUS_SPI_MISO) J6.B39(DATA:BUS_SPI_MOSI) J6.B40(POWER:PWR_CTRL_SW) J6.B41(GPIO:GPIO-7) J6.B46(JTAG:BUS_JTAG_EN-0) J6.B48(JTAG:BUS_JTAG_EN-2) J6.B49(JTAG:BUS_JTAG_EN-3) Q9.1(A:S) Q9.2(A:G) Q9.6(A:D)

### Notes on the sheet
- CAD Note:
  Decoupling
- 7A2>
- 7A4>
- 7A6>
- <10A1 | 7B2>
- 7B4>
- <10A1 | 7B6>
- 7C2>
- 7C4>
- 7C6>
- 7D2>
- Note:
  STM32 includes
  JTAG termination
- 7D4>
- 7D6>
- 7D2>
- 8A2>
- 8A4>
- 8A6>
- 10B1> | 8B2>
- 8B4>
- <10A1 | 8B6>
- 8C2>
- <7B5
- IFJR drives JTAG_EN_PMIC
  high when programming.
  This ORing FETs ensure
  its power rail stays on when
  programming.
- 10A1> | 10C1> | 10C1>
- 10A1> | 10C1> | 10A1>
- 10A1> | 10C1> | 10C1>
- 10A1> | 10C1> | 10C1>
- 10D1> | 10B1> | 10A1>
- 10D1> | 10B1> | 10A1>
- 10C1> | 10C1> | 10A1>
- 10C1> | 10C1> | 10C1>
- <10B4>
- <10A4
- <10A4>
- 10B1>
- <10B4>

## Sheet 10 of 13
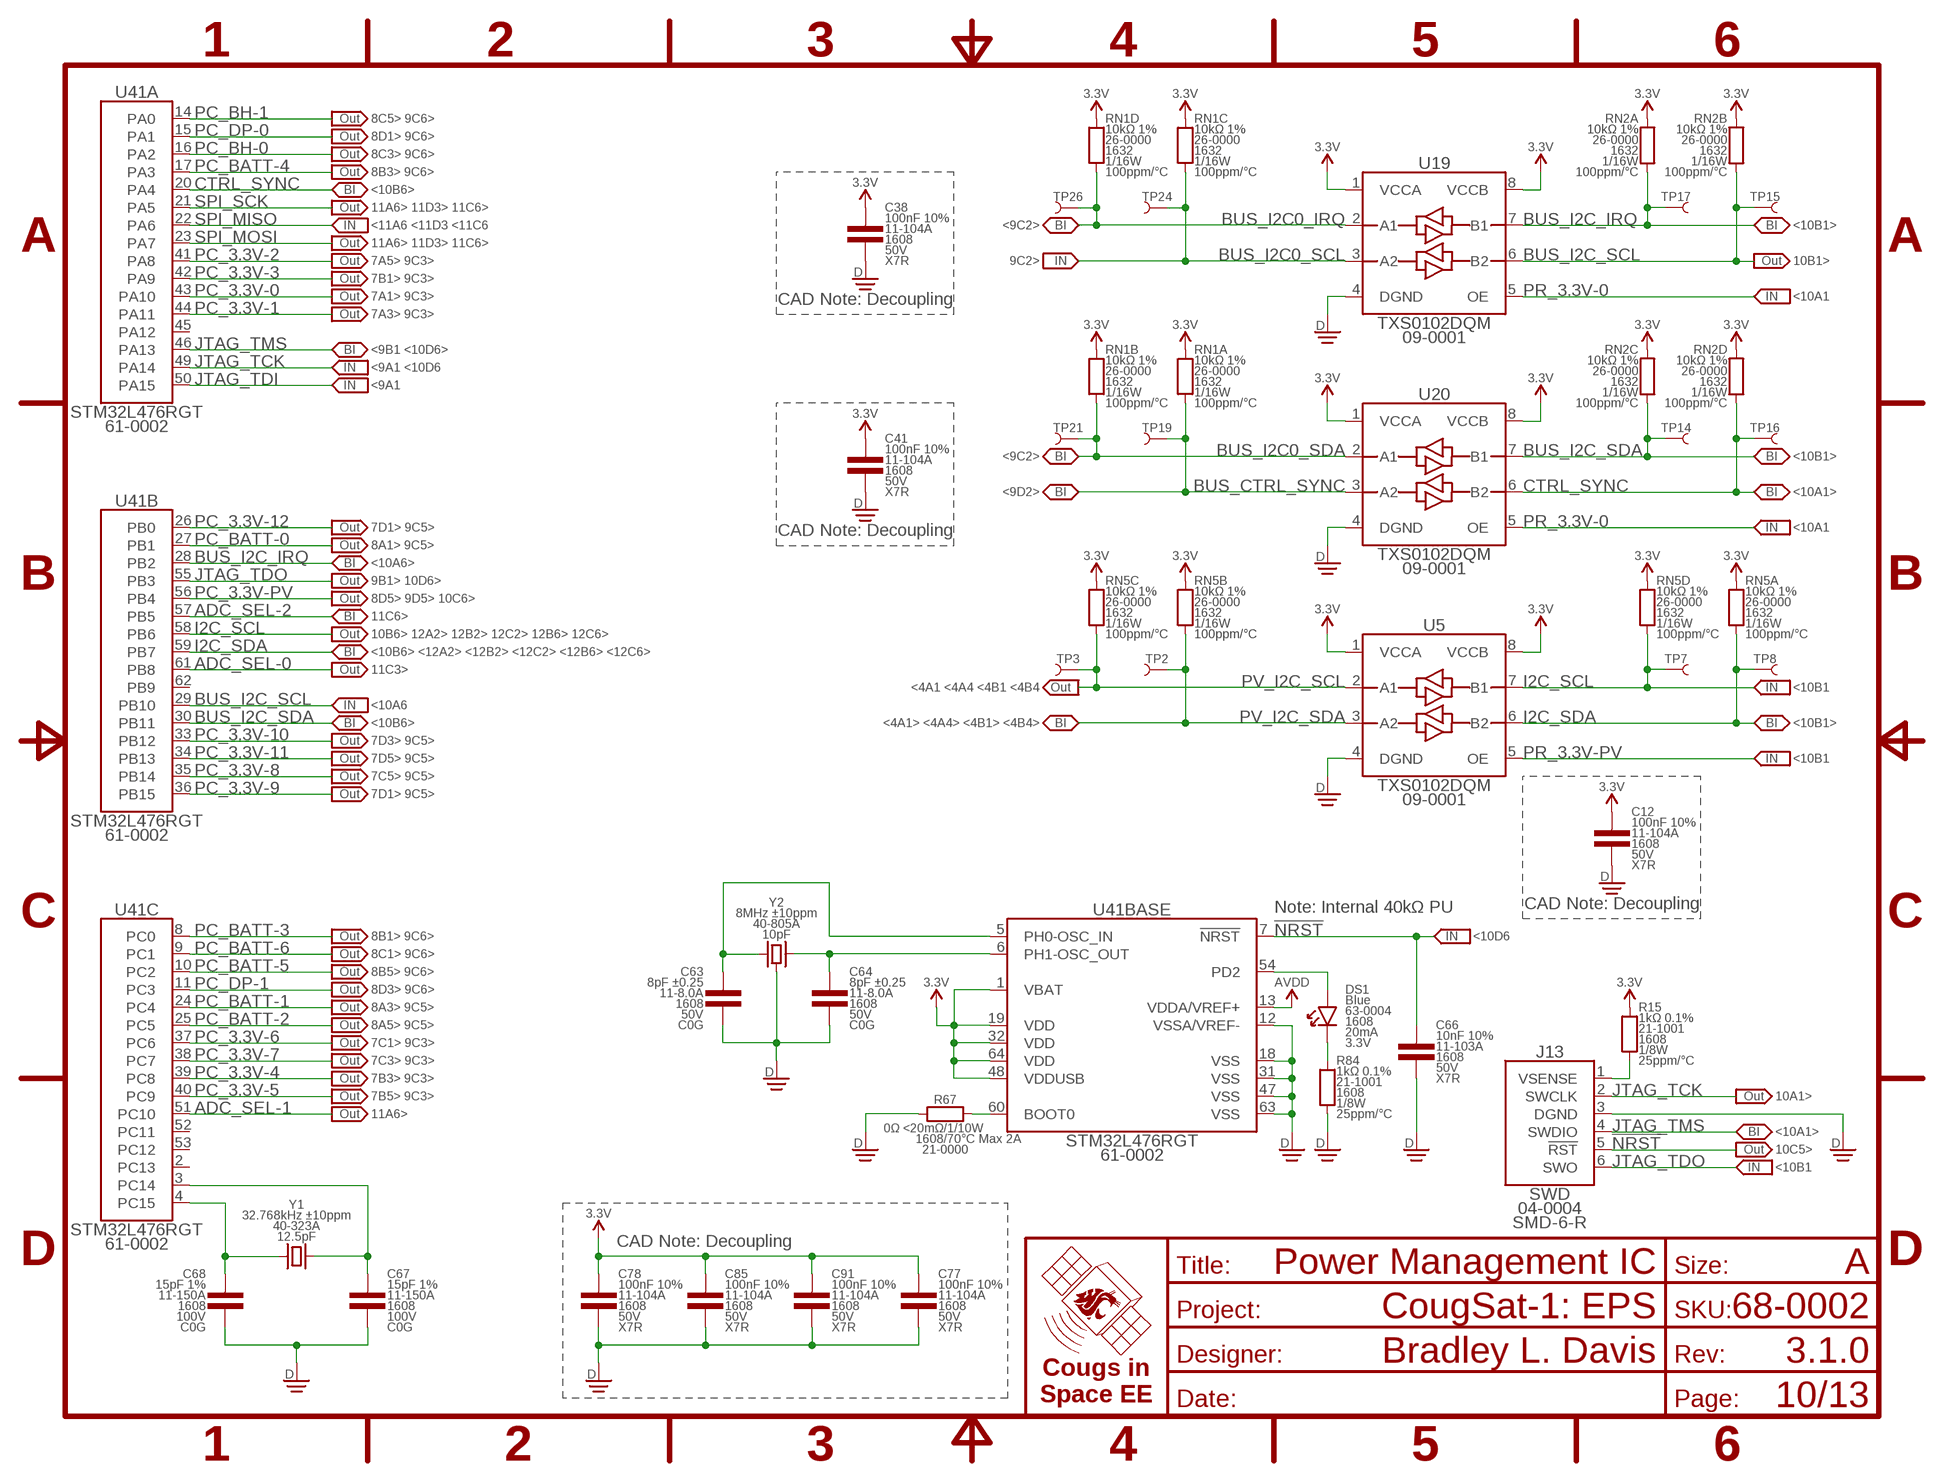
[diagram p9: schematic, sheet 10]
FRAME6 (FRAME-A): TITLE: Power Management IC

### Parts
C12  100nF 10%  CAP-V-100NF-1608  [1608]
C38  100nF 10%  CAP-V-100NF-1608  [1608]
C41  100nF 10%  CAP-V-100NF-1608  [1608]
C63  8pF ±0.25  CAP-V-8PF-1608  [1608]
C64  8pF ±0.25  CAP-V-8PF-1608  [1608]
C66  10nF 10%  CAP-V-10NF-1608  [1608]
C67  15pF 1%  CAP-V-15PF-1608  [1608]
C68  15pF 1%  CAP-V-15PF-1608  [1608]
C77  100nF 10%  CAP-V-100NF-1608  [1608]
C78  100nF 10%  CAP-V-100NF-1608  [1608]
C85  100nF 10%  CAP-V-100NF-1608  [1608]
C91  100nF 10%  CAP-V-100NF-1608  [1608]
DS1  Blue  LED-V-BLU-1608  [1608-POL]
J13  SWD  SWDSMD-6-R  [SMD2.54-1X06-R]
R15  1kΩ 0.1%  RES-V-1K-1608  [1608]
R67  0Ω <20mΩ  RES-H-0-1608  [1608]
R84  1kΩ 0.1%  RES-V-1K-1608  [1608]
RN1  10kΩ 1%  RES-4-V-10K-1632  [1632]
RN2  10kΩ 1%  RES-4-V-10K-1632  [1632]
RN5  10kΩ 1%  RES-4-V-10K-1632  [1632]
TP2  TEST_POINT-SMD-C-1.25  [SMD-C-1.25]
TP3  TEST_POINT-SMD-C-1.25  [SMD-C-1.25]
TP7  TEST_POINT-SMD-C-1.25  [SMD-C-1.25]
TP8  TEST_POINT-SMD-C-1.25  [SMD-C-1.25]
TP14  TEST_POINT-SMD-C-1.25  [SMD-C-1.25]
TP15  TEST_POINT-SMD-C-1.25  [SMD-C-1.25]
TP16  TEST_POINT-SMD-C-1.25  [SMD-C-1.25]
TP17  TEST_POINT-SMD-C-1.25  [SMD-C-1.25]
TP19  TEST_POINT-SMD-C-1.25  [SMD-C-1.25]
TP21  TEST_POINT-SMD-C-1.25  [SMD-C-1.25]
TP24  TEST_POINT-SMD-C-1.25  [SMD-C-1.25]
TP26  TEST_POINT-SMD-C-1.25  [SMD-C-1.25]
U5  TXS0102DQM  LEVEL_SHIFTER-2BIT-XSON-8  [X2SON-8]
U19  TXS0102DQM  LEVEL_SHIFTER-2BIT-XSON-8  [X2SON-8]
U20  TXS0102DQM  LEVEL_SHIFTER-2BIT-XSON-8  [X2SON-8]
U41  STM32L476RGT  STM32-64P-L476RGT  [QFP-64-1010]
Y1  32.768kHz ±10ppm  CRYSTAL-32.768K-SMD-3215  [SMD-3215]
Y2  8MHz ±10ppm  CRYSTAL-GROUNDED-8M-SMD-5032  [SMD-5032]

### Nets
3.3V [power]: C12.1 C38.1 C41.1 C77.1 C78.1 C85.1 C91.1 R15.2 RN1.5 RN1.6 RN1.7 RN1.8 RN2.5 RN2.6 RN2.7 RN2.8 RN5.5 RN5.6 RN5.7 RN5.8 U5.1(VCCA) U5.8(VCCB) U19.1(VCCA) U19.8(VCCB) U20.1(VCCA) U20.8(VCCB) U41.1(BASE:VBAT) U41.19(BASE:VDD) U41.32(BASE:VDD) U41.48(BASE:VDDUSB) U41.64(BASE:VDD) ; also sheet 4,6,7,8,9,11,12
!NRST: C66.1 J13.5(!RST) U41.7(BASE:!NRST)
ADC_SEL-0: U41.61(B:PB8) ; also sheet 11
ADC_SEL-1: U41.51(C:PC10) ; also sheet 11
ADC_SEL-2: U41.57(B:PB5) ; also sheet 11
AVDD [power]: U41.13(BASE:VDDA/VREF+) ; also sheet 5,6,7,8,11,12
BOOT0: R67.2 U41.60(BASE:BOOT0)
BUS_CTRL_SYNC: RN1.1 TP19.1 U20.3(A2) ; also sheet 9
BUS_I2C0_IRQ: RN1.4 TP26.1 U19.2(A1) ; also sheet 9
BUS_I2C0_SCL: RN1.3 TP24.1 U19.3(A2) ; also sheet 9
BUS_I2C0_SDA: RN1.2 TP21.1 U20.2(A1) ; also sheet 9
BUS_I2C_IRQ: RN2.1 TP17.1 U19.7(B1) U41.28(B:PB2)
BUS_I2C_SCL: RN2.2 TP15.1 U19.6(B2) U41.29(B:PB10)
BUS_I2C_SDA: RN2.3 TP14.1 U20.7(B1) U41.30(B:PB11)
CTRL_SYNC: RN2.4 TP16.1 U20.6(B2) U41.20(A:PA4)
DGND [power]: C12.2 C38.2 C41.2 C63.2 C64.2 C66.2 C67.2 C68.2 C77.2 C78.2 C85.2 C91.2 J13.3(DGND) R67.1 R84.1 U5.4(DGND) U19.4(DGND) U20.4(DGND) U41.12(BASE:VSSA/VREF-) U41.18(BASE:VSS) U41.31(BASE:VSS) U41.47(BASE:VSS) U41.63(BASE:VSS) Y2.2(GND) Y2.4(GND) ; also sheet 2,9,11,12
I2C_SCL: RN5.4 TP7.1 U5.7(B1) U41.58(B:PB6) ; also sheet 12
I2C_SDA: RN5.1 TP8.1 U5.6(B2) U41.59(B:PB7) ; also sheet 12
JTAG_TCK: J13.2(SWCLK) U41.49(A:PA14) ; also sheet 9
JTAG_TDI: U41.50(A:PA15) ; also sheet 9
JTAG_TDO: J13.6(SWO) U41.55(B:PB3) ; also sheet 9
JTAG_TMS: J13.4(SWDIO) U41.46(A:PA13) ; also sheet 9
OSC32_IN: C67.1 U41.3(C:PC14) Y1.2
OSC32_OUT: C68.1 U41.4(C:PC15) Y1.1
OSC_IN: C63.1 U41.5(BASE:PH0-OSC_IN) Y2.1
OSC_OUT: C64.1 U41.6(BASE:PH1-OSC_OUT) Y2.3
PC_3.3V-0: U41.43(A:PA10) ; also sheet 7,9
PC_3.3V-1: U41.44(A:PA11) ; also sheet 7,9
PC_3.3V-2: U41.41(A:PA8) ; also sheet 7,9
PC_3.3V-3: U41.42(A:PA9) ; also sheet 7,9
PC_3.3V-4: U41.39(C:PC8) ; also sheet 7,9
PC_3.3V-5: U41.40(C:PC9) ; also sheet 7,9
PC_3.3V-6: U41.37(C:PC6) ; also sheet 7,9
PC_3.3V-7: U41.38(C:PC7) ; also sheet 7,9
PC_3.3V-8: U41.35(B:PB14) ; also sheet 7,9
PC_3.3V-9: U41.36(B:PB15) ; also sheet 7,9
PC_3.3V-10: U41.33(B:PB12) ; also sheet 7,9
PC_3.3V-11: U41.34(B:PB13) ; also sheet 7,9
PC_3.3V-12: U41.26(B:PB0) ; also sheet 7,9
PC_3.3V-PV: U41.56(B:PB4) ; also sheet 8,9
PC_BATT-0: U41.27(B:PB1) ; also sheet 8,9
PC_BATT-1: U41.24(C:PC4) ; also sheet 8,9
PC_BATT-2: U41.25(C:PC5) ; also sheet 8,9
PC_BATT-3: U41.8(C:PC0) ; also sheet 8,9
PC_BATT-4: U41.17(A:PA3) ; also sheet 8,9
PC_BATT-5: U41.10(C:PC2) ; also sheet 8,9
PC_BATT-6: U41.9(C:PC1) ; also sheet 8,9
PC_BH-0: U41.16(A:PA2) ; also sheet 8,9
PC_BH-1: U41.14(A:PA0) ; also sheet 8,9
PC_DP-0: U41.15(A:PA1) ; also sheet 8,9
PC_DP-1: U41.11(C:PC3) ; also sheet 8,9
PMIC_LED-A: DS1.A U41.54(BASE:EXTRA_PIN)
PMIC_LED-C: DS1.C R84.2
PR_3.3V-0 [power]: U19.5(OE) U20.5(OE) ; also sheet 7,9
PR_3.3V-PV [power]: U5.5(OE) ; also sheet 4,8
PV_I2C_SCL: RN5.3 TP3.1 U5.2(A1) ; also sheet 4
PV_I2C_SDA: RN5.2 TP2.1 U5.3(A2) ; also sheet 4
SPI_MISO: U41.22(A:PA6) ; also sheet 11
SPI_MOSI: U41.23(A:PA7) ; also sheet 11
SPI_SCK: U41.21(A:PA5) ; also sheet 11
SWD_VSENSE: J13.1(VSENSE) R15.1
Unconnected: U41.2(C:PC13) U41.45(A:PA12) U41.52(C:PC11) U41.53(C:PC12) U41.62(B:PB9)

### Notes on the sheet
- 8C5> 9C6>
- 8D1> 9C6>
- 8C3> 9C6>
- 8B3> 9C6>
- <10B6>
- 11A6> 11D3> 11C6>
- <11A6 <11D3 <11C6 | <9C2> | <10B1>
- 11A6> 11D3> 11C6>
- 7A5> 9C3> | 9C2> | 10B1>
- 7B1> 9C3>
- 7A1> 9C3> | <10A1
- CAD Note: Decoupling
- 7A3> 9C3>
- <9B1 <10D6>
- <9A1 <10D6
- <9A1
- <9C2> | <10B1>
- <9D2> | <10A1>
- 7D1> 9C5> | <10A1
- CAD Note: Decoupling
- 8A1> 9C5>
- <10A6>
- 9B1> 10D6>
- 8D5> 9D5> 10C6>
- 11C6>
- 10B6> 12A2> 12B2> 12C2> 12B6> 12C6>
- <10B6> <12A2> <12B2> <12C2> <12B6> <12C6>
- 11C3>
- <4A1 <4A4 <4B1 <4B4 | <10B1
- <10A6
- <10B6> | <4A1> <4A4> <4B1> <4B4> | <10B1>
- 7D3> 9C5>
- 7D5> 9C5> | <10B1
- 7C5> 9C5>
- 7D1> 9C5>
- Note: Internal 40kΩ PU
- CAD Note: Decoupling
- 8B1> 9C6> | <10D6
- 8C1> 9C6>
- 8B5> 9C6>
- 8D3> 9C6>
- 8A3> 9C5>
- 8A5> 9C5>
- 7C1> 9C3>
- 7C3> 9C3>
- 7B3> 9C3>
- 7B5> 9C3> | 10A1>
- 11A6>
- <10A1>
- 10C5>
- <10B1
- CAD Note: Decoupling